# Altium project LPCXpresso55SXX.PrjPcb (part 1 of 2)
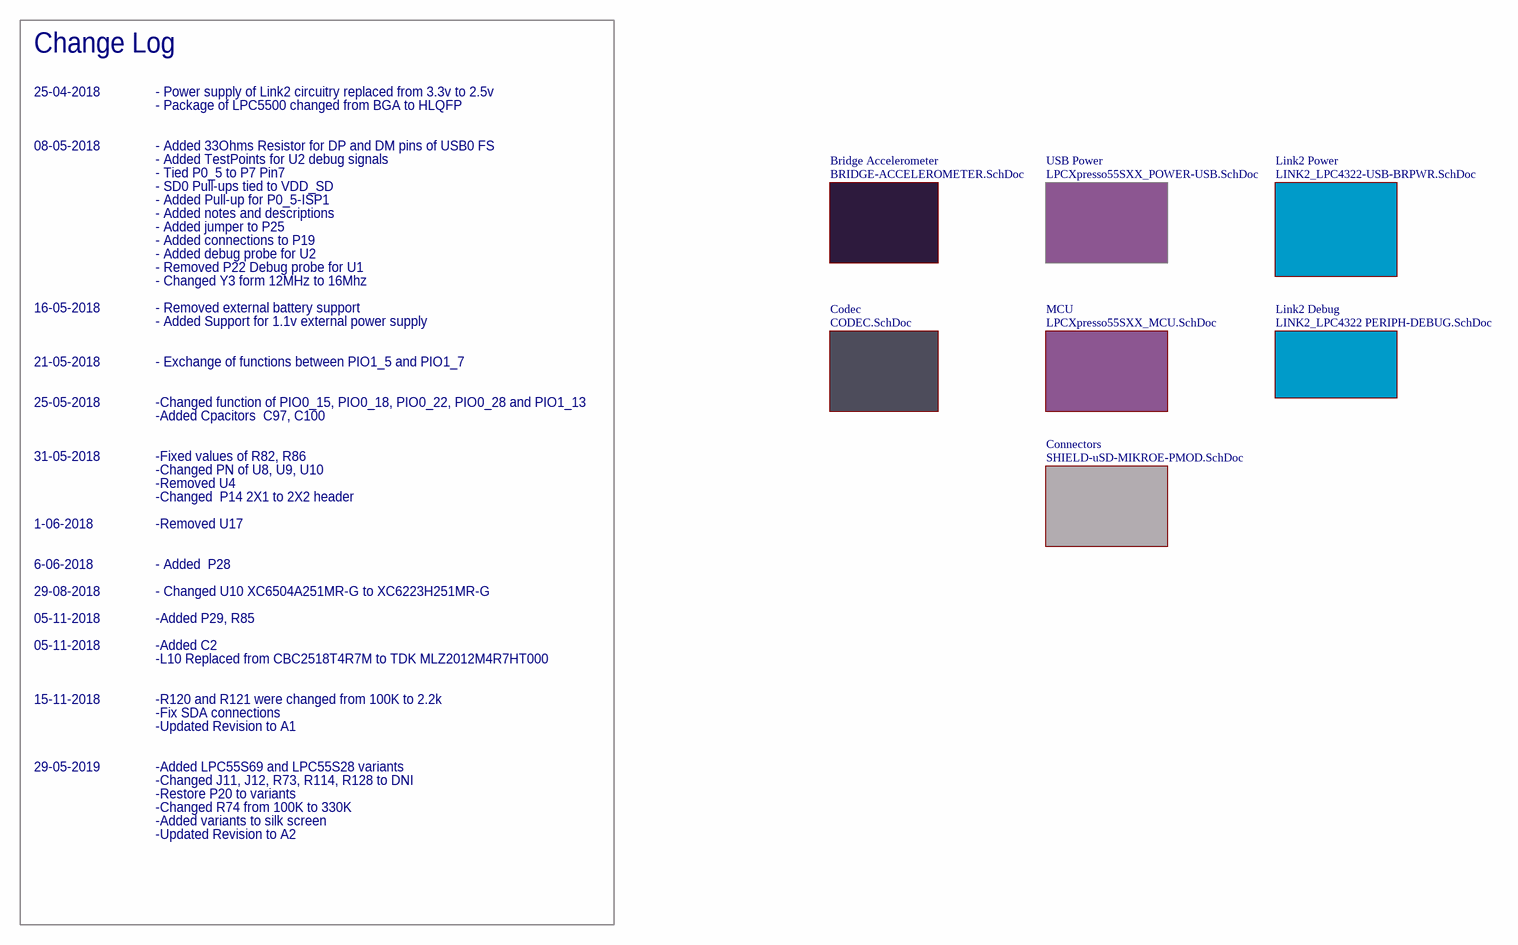
[diagram p0: LPCXpresso55SXX.SchDoc]
8 sheets, 336 parts. Net scope: global (net labels, ports and power ports of the same name join across sheets).
Board file: LPCXpresso55SXX.PcbDoc
Sheets:
  LPCXpresso55SXX.SchDoc
    USB Power = LPCXpresso55SXX_POWER-USB.SchDoc
    MCU = LPCXpresso55SXX_MCU.SchDoc
    Connectors = SHIELD-uSD-MIKROE-PMOD.SchDoc
    Bridge Accelerometer = BRIDGE-ACCELEROMETER.SchDoc
    Codec = CODEC.SchDoc
    Link2 Debug = LINK2_LPC4322 PERIPH-DEBUG.SchDoc
    Link2 Power = LINK2_LPC4322-USB-BRPWR.SchDoc

## Sheet LPCXpresso55SXX.SchDoc
size A3; CheckedBy: José Ogando; Engineer: Eduardo Teofilo; Revision: A2; SheetNumber: 1; SheetTotal: 8

### Sub-sheets
Bridge Accelerometer = BRIDGE-ACCELEROMETER.SchDoc: no entries
Codec = CODEC.SchDoc: no entries
Connectors = SHIELD-uSD-MIKROE-PMOD.SchDoc: no entries
Link2 Debug = LINK2_LPC4322 PERIPH-DEBUG.SchDoc: no entries
Link2 Power = LINK2_LPC4322-USB-BRPWR.SchDoc: no entries
MCU = LPCXpresso55SXX_MCU.SchDoc: no entries
USB Power = LPCXpresso55SXX_POWER-USB.SchDoc: no entries

### Notes on the sheet
- Change Log
- 25-04-2018
- - Power supply of Link2 circuitry replaced from 3.3v to 2.5v
- - Package of LPC5500 changed from BGA to HLQFP
- 08-05-2018
- - Added 33Ohms Resistor for DP and DM pins of USB0 FS
- - Added TestPoints for U2 debug signals
- - Tied P0_5 to P7 Pin7
- - SD0 Pull-ups tied to VDD_SD
- - Added Pull-up for P0_5-ISP1
- - Added notes and descriptions
- - Added jumper to P25
- - Added connections to P19
- - Added debug probe for U2
- - Removed P22 Debug probe for U1
- 16-05-2018
- - Changed Y3 form 12MHz to 16Mhz
- - Removed external battery support
- - Added Support for 1.1v external power supply
- 21-05-2018
- 25-05-2018
- - Exchange of functions between PIO1_5 and PIO1_7
- -Changed function of PIO0_15, PIO0_18, PIO0_22, PIO0_28 and PIO1_13
- 31-05-2018
- -Added Cpacitors  C97, C100
- -Fixed values of R82, R86
- -Changed PN of U8, U9, U10
- 1-06-2018
- -Removed U4
- -Changed  P14 2X1 to 2X2 header
- -Removed U17
- 6-06-2018
- 29-08-2018
- - Added  P28
- - Changed U10 XC6504A251MR-G to XC6223H251MR-G
- 05-11-2018
- -Added P29, R85
- -Added C2
- -L10 Replaced from CBC2518T4R7M to TDK MLZ2012M4R7HT000
- 15-11-2018
- -R120 and R121 were changed from 100K to 2.2k
- -Fix SDA connections
- -Updated Revision to A1
- 29-05-2019
- -Changed J11, J12, R73, R114, R128 to DNI
- -Restore P20 to variants
- -Changed R74 from 100K to 330K
- -Added LPC55S69 and LPC55S28 variants
- -Updated Revision to A2
- -Added variants to silk screen
- Elaborated by:
- Checked by:
- Revision:
- Last revision date:

## Sheet LPCXpresso55SXX_POWER-USB.SchDoc
size A3; CheckedBy: José Ogando; Engineer: Eduardo Teofilo; Revision: A2; SheetNumber: 2; SheetTotal: 8
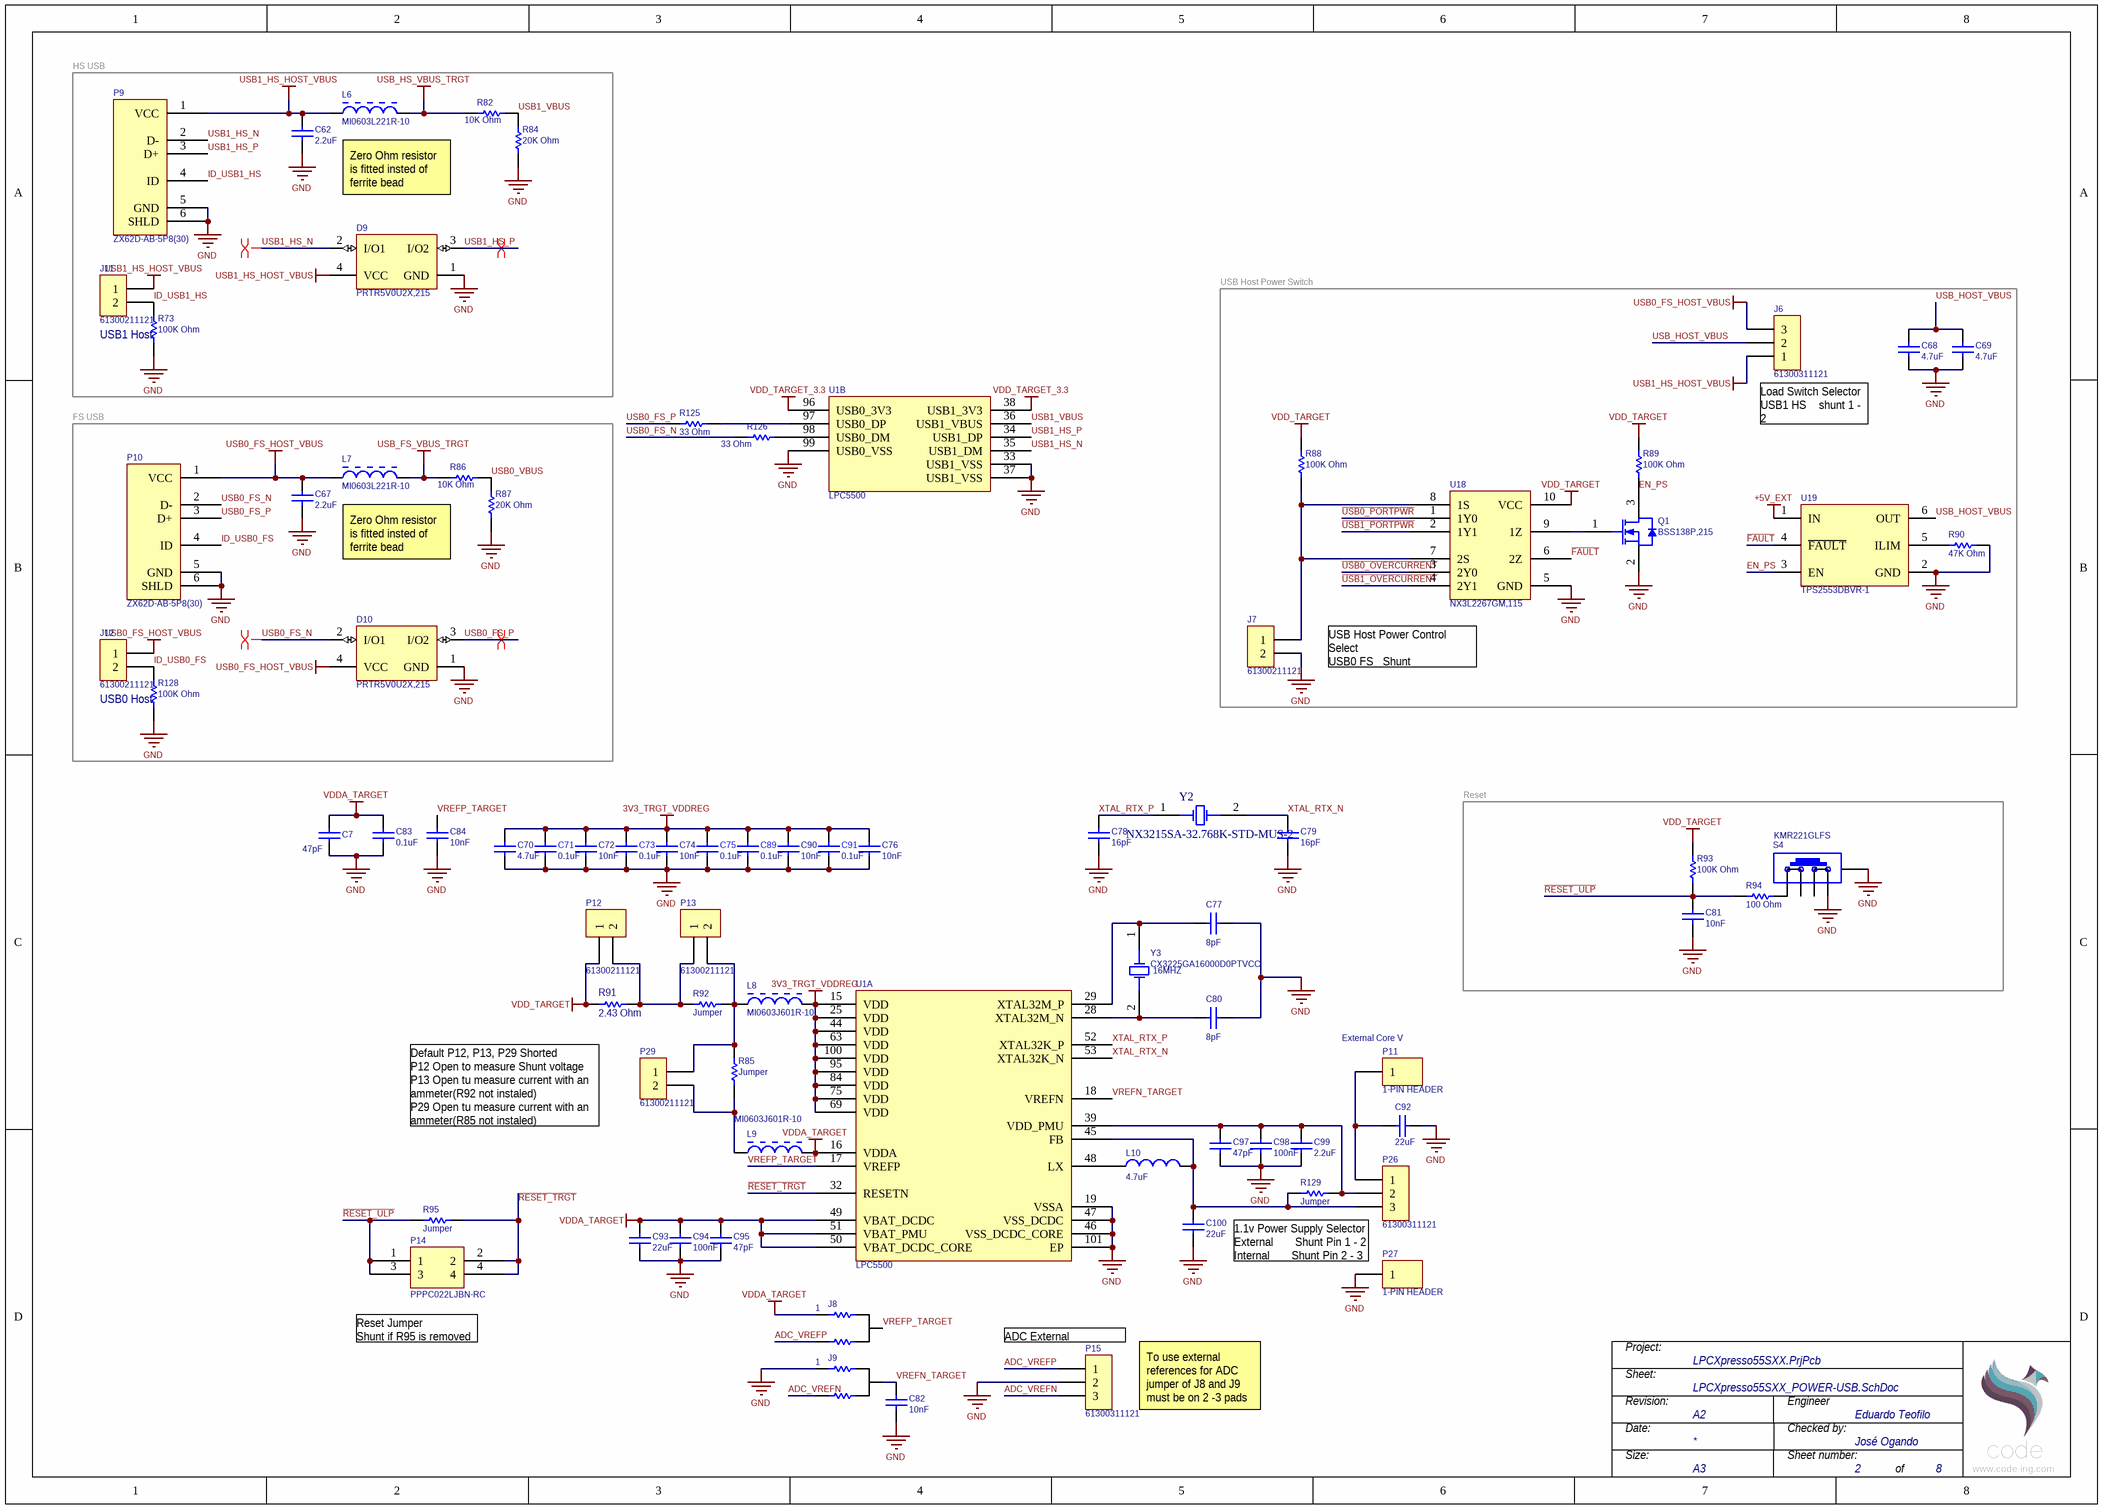
[diagram p1: LPCXpresso55SXX_POWER-USB.SchDoc]

### Parts
C7  value 47pF  [CAPC0402(1005)60_L]  (hidden comment: CAP 47pF 16V 0402(1005))
C62  value 2.2uF  [CAPC0402(1005)60_L]  (hidden comment: CAP 2.2uF 10V 0402(1005))
C67  value 2.2uF  [CAPC0402(1005)60_L]  (hidden comment: CAP 2.2uF 10V 0402(1005))
C68  value 4.7uF  [CAPC0603(1608)100_L]  (hidden comment: CAP 4.7uF 10V 0603(1608))
C69  value 4.7uF  [CAPC0603(1608)100_L]  (hidden comment: CAP 4.7uF 10V 0603(1608))
C70  value 4.7uF  [CAPC0603(1608)100_L]  (hidden comment: CAP 4.7uF 10V 0603(1608))
C71  value 0.1uF  [CAPC1005]  (hidden comment: CC0402KRX7R7BB104)
C72  value 10nF  [CAPC0402(1005)60_L]  (hidden comment: CAP 10nF 25V 0402(1005))
C73  value 0.1uF  [CAPC1005]  (hidden comment: CC0402KRX7R7BB104)
C74  value 10nF  [CAPC0402(1005)60_L]  (hidden comment: CAP 10nF 25V 0402(1005))
C75  value 0.1uF  [CAPC1005]  (hidden comment: CC0402KRX7R7BB104)
C76  value 10nF  [CAPC0402(1005)60_L]  (hidden comment: CAP 10nF 25V 0402(1005))
C77  value 8pF  [0402_L]  (hidden comment: GRM1555C1E8R0CA01D)
C78  value 16pF  [CAPC0402(1005)60_L]  (hidden comment: CAP 16pF 25V 0402(1005))
C79  value 16pF  [CAPC0402(1005)60_L]  (hidden comment: CAP 16pF 25V 0402(1005))
C80  value 8pF  [0402_L]  (hidden comment: GRM1555C1E8R0CA01D)
C81  value 10nF  [CAPC0402(1005)60_L]  (hidden comment: CAP 10nF 25V 0402(1005))
C82  value 10nF  [CAPC0402(1005)60_L]  (hidden comment: CAP 10nF 25V 0402(1005))
C83  value 0.1uF  [CAPC1005]  (hidden comment: CC0402KRX7R7BB104)
C84  value 10nF  [CAPC0402(1005)60_L]  (hidden comment: CAP 10nF 25V 0402(1005))
C89  value 0.1uF  [CAPC1005]  (hidden comment: CC0402KRX7R7BB104)
C90  value 10nF  [CAPC0402(1005)60_L]  (hidden comment: CAP 10nF 25V 0402(1005))
C91  value 0.1uF  [CAPC1005]  (hidden comment: CC0402KRX7R7BB104)
C92  value 22uF  [CAPC0805(2012)145_L]  (hidden comment: CAP 22uF 16V 0805(2012))
C93  value 22uF  [CAPC0805(2012)145_L]  (hidden comment: CAP 22uF 16V 0805(2012))
C94  value 100nF  [CAPC0603(1608)100_L]  (hidden comment: CAP 100nF 25V 0603(1608))
C95  value 47pF  [CAPC0603(1608)100_L]  (hidden comment: CAP 47pF 16V 0603(1608))
C97  value 47pF  [CAPC0603(1608)100_L]  (hidden comment: CAP 47pF 16V 0603(1608))
C98  value 100nF  [CAPC0603(1608)100_L]  (hidden comment: CAP 100nF 25V 0603(1608))
C99  value 2.2uF  [CAPC0402(1005)60_L]  (hidden comment: CAP 2.2uF 10V 0402(1005))
C100  value 22uF  [CAPC0805(2012)145_L]  (hidden comment: CAP 22uF 16V 0805(2012))
D9  PRTR5V0U2X,215  [NXP-SOT143B-4_V]
D10  PRTR5V0U2X,215  [NXP-SOT143B-4_V]
J6  61300311121  [61300311121]
J7  61300211121  [61300211121]
J8  Resistor - Jumper  [0402_R - JMP]  (value not drawn)
J9  Resistor - Jumper  [0402_R - JMP]  (value not drawn)
J11  61300211121  [61300211121]
J12  61300211121  [61300211121]
L6  MI0603L221R-10  [LIRD-HZ0603C601R-10-2_V]
L7  MI0603L221R-10  [LIRD-HZ0603C601R-10-2_V]
L8  MI0603J601R-10  [LIRD-MI0603J601R-10_V]
L9  MI0603J601R-10  [LIRD-MI0603J601R-10_V]
L10  value 4.7uF  [0805(2012)]  (hidden comment: MLZ2012M4R7HT000)
P9  ZX62D-AB-5P8(30)  [ZX62D-AB-5P8(30)]
P10  ZX62D-AB-5P8(30)  [ZX62D-AB-5P8(30)]
P11  1-PIN HEADER  [HDR1X1]
P12  61300211121  [61300211121]
P13  61300211121  [61300211121]
P14  PPPC022LJBN-RC  [PPPC022LJBN-RC]
P15  61300311121  [61300311121]
P26  61300311121  [61300311121]
P27  1-PIN HEADER  [HDR1X1]
P29  61300211121  [61300211121]
Q1  BSS138P,215  [NXP-SOT23_N]
R73  value 100K Ohm  [RESC1005X40X25LL05T05]  (hidden comment: ERJ-2RKF1003X)
R82  value 10K Ohm  [RESC0402(1005)_N]  (hidden comment: 10K 1% 0402(1005))
R84  value 20K Ohm  [RESC0402(1005)_M]  (hidden comment: 20K 1% 0402(1005))
R85  Jumper  [RESC0402(1005)_L]
R86  value 10K Ohm  [RESC0402(1005)_N]  (hidden comment: 10K 1% 0402(1005))
R87  value 20K Ohm  [RESC0402(1005)_M]  (hidden comment: 20K 1% 0402(1005))
R88  value 100K Ohm  [RESC1005X40X25LL05T05]  (hidden comment: ERJ-2RKF1003X)
R89  value 100K Ohm  [RESC1005X40X25LL05T05]  (hidden comment: ERJ-2RKF1003X)
R90  value 47K Ohm  [RESC0402(1005)_L]  (hidden comment: 47K 1% 0402(1005))
R91  value 2.43 Ohm  [RESC0402(1005)_L]  (hidden comment: 2R43 1% 0402(1005))
R92  Jumper  [RESC0402(1005)_L]
R93  value 100K Ohm  [RESC1005X40X25LL05T05]  (hidden comment: ERJ-2RKF1003X)
R94  value 100 Ohm  [RESC0402(1005)_L]  (hidden comment: 100R 5% 0402(1005))
R95  Jumper  [RESC0402(1005)_L]
R125  value 33 Ohm  [RESC0402(1005)_L]  (hidden comment: 33R 1% 0402(1005))
R126  value 33 Ohm  [RESC0402(1005)_L]  (hidden comment: 33R 1% 0402(1005))
R128  value 100K Ohm  [RESC1005X40X25LL05T05]  (hidden comment: ERJ-2RKF1003X)
R129  Jumper  [RESC0402(1005)_L]
S4  KMR221GLFS  [KMR221GLFS]
U1  LPC5500  [LQFP EP 100]  (parts A,B of 4)
U18  NX3L2267GM,115  [XQFN10]
U19  TPS2553DBVR-1  [DBV0006A_N]
Y2  NX3215SA-32.768K-STD-MUS-2  [2-SMD 3.2x1.5mm]
Y3  CX3225GA16000D0PTVCC  value 16MHZ  [CX3225GA]

### Blocks framed on the sheet
USB1 Host: C62 D9 J11 L6 P9 R73 R82 R84
USB Host Power Switch: C68 C69 J6 J7 Q1 R88-R90 U18 U19
USB0 Host: C67 D10 J12 L7 P10 R86 R87 R128
Reset: C81 R93 R94 S4

### Nets
3V3_TRGT_VDDREG: C70.2 C71.1 C72.2 C73.1 C74.2 C75.1 C76.2 C89.1 C90.2 C91.1 L8.2 U1.15(VDD) U1.25(VDD) U1.44(VDD) U1.63(VDD) U1.69(VDD) U1.75(VDD) U1.84(VDD) U1.95(VDD) U1.100(VDD)
+5V_EXT: U19.1(IN)
GND: C7.1 C62.1 C67.1 C68.1 C69.1 C70.1 C71.2 C72.1 C73.2 C74.1 C75.2 C76.1 C77.2 C78.1 C79.1 C80.2 C81.1 C82.1 C83.2 C84.1 C89.2 C90.1 C91.2 C92.2 C93.1 C94.1 C95.1 C97.1 C98.1 C99.1 C100.2 D9.1(GND) D10.1(GND) J7.2 J9.1 P9.5(GND) P9.6(SHLD) P10.5(GND) P10.6(SHLD) P15.2 P27.1 Q1.2(S) R73.1 R84.1 R87.1 R90.2 R128.1 S4.2 S4.5 U1.19(VSSA) U1.33(USB1_VSS) U1.37(USB1_VSS) U1.46(VSS_DCDC_CORE) U1.47(VSS_DCDC) U1.99(USB0_VSS) U1.101(EP) U18.5(GND) U19.2(GND)
USB0_FS_HOST_VBUS: C67.2 D10.4(VCC) J6.3 J12.1 L7.1 P10.1(VCC)
USB1_HS_HOST_VBUS: C62.2 D9.4(VCC) J6.1 J11.1 L6.1 P9.1(VCC)
USB_FS_VBUS_TRGT: L7.2 R86.1
USB_HS_VBUS_TRGT: L6.2 R82.1
VDD_TARGET: P12.1 R88.2 R89.2 R91.1 R93.2 U18.10(VCC)
VDD_TARGET_3.3: U1.38(USB1_3V3) U1.96(USB0_3V3)
VDDA_TARGET: C7.2 C83.1 C93.2 C94.2 C95.2 J8.1 L9.2 U1.16(VDDA) U1.49(VBAT_DCDC) U1.50(VBAT_DCDC_CORE) U1.51(VBAT_PMU)
ADC_VREFN: J9.3 P15.3
ADC_VREFP: J8.3 P15.1
EN_PS: Q1.3(D) R89.1 U19.3(EN)
~{FAULT}: U18.6(2Z) U19.4(~{FAULT})
ID_USB0_FS: J12.2 P10.4(ID) R128.2
ID_USB1_HS: J11.2 P9.4(ID) R73.2
~{RESET_TRGT}: P14.2 P14.4 R95.1 U1.32(RESETN)
~{RESET_ULP}: C81.2 P14.1 P14.3 R93.1 R94.1 R95.2
~{USB0_OVERCURRENT}: U18.3(2Y0)
~{USB0_PORTPWR}: U18.1(1Y0)
~{USB1_OVERCURRENT}: U18.4(2Y1)
~{USB1_PORTPWR}: U18.2(1Y1)
USB0_FS_N: D10.2(I/O1) P10.2(D-) R126.1
USB0_FS_P: D10.3(I/O2) P10.3(D+) R125.1
USB0_VBUS: R86.2 R87.2
USB1_HS_N: D9.2(I/O1) P9.2(D-) U1.35(USB1_DM)
USB1_HS_P: D9.3(I/O2) P9.3(D+) U1.34(USB1_DP)
USB1_VBUS: R82.2 R84.2 U1.36(USB1_VBUS)
USB_HOST_VBUS: C68.2 C69.2 J6.2 U19.6(OUT)
VREFN_TARGET: C82.2 J9.2 U1.18(VREFN)
VREFP_TARGET: C84.2 J8.2 U1.17(VREFP)
XTAL_RTX_N: C79.2 U1.53(XTAL32K_N) Y2.2(OSC2)
XTAL_RTX_P: C78.2 U1.52(XTAL32K_P) Y2.1(OSC1)
NetC77_1: C77.1 U1.29(XTAL32M_P) Y3.1(OSC1)
NetC80_1: C80.1 U1.28(XTAL32M_N) Y3.2
NetC92_1: C92.1 P11.1 P26.1
NetC97_2: C97.2 C98.2 C99.2 P26.2 R129.1 U1.39(VDD_PMU)
NetC100_1: C100.1 L10.2 P26.3 R129.2 U1.45(FB)
NetJ7_1: J7.1 R88.1 U18.7(2S) U18.8(1S)
NetL8_1: L8.1 P13.2 P29.1 R85.1 R92.1
NetL9_1: L9.1 P29.2 R85.2
NetL10_1: L10.1 U1.48(LX)
NetP12_2: P12.2 P13.1 R91.2 R92.2
NetQ1_1: Q1.1(G) U18.9(1Z)
NetR90_1: R90.1 U19.5(ILIM)
NetR94_2: R94.2 S4.1
NetR125_2: R125.2 U1.97(USB0_DP)
NetR126_2: R126.2 U1.98(USB0_DM)

Not connected (* = marked no-connect by the designer): S4 3 4

### Layout directives
differential pair: USB0_FS_N, USB0_FS_P, USB1_HS_N, USB1_HS_P

### Notes on the sheet
- HS USB
- Zero Ohm resistor is fitted insted of ferrite bead
- FS USB
- (near J6) Load Switch Selector
  USB1 HS    shunt 1 - 2
  USB0 FS     shunt 2 -3
- USB Host Power Control Select
  USB0 FS   Shunt
  USB1 HS  Open
- (near P11) External Core V
- (near R91) Default P12, P13, P29 Shorted
  P12 Open to measure Shunt voltage
  P13 Open tu measure current with an ammeter(R92 not instaled)
  P29 Open tu measure current with an ammeter(R85 not instaled)
- 1.1v Power Supply Selector
  External       Shunt Pin 1 - 2
  Internal       Shunt Pin 2 - 3
- (near J8) 1
- (near P14) Reset Jumper
  Shunt if R95 is removed
- (near J9) 1
- (near P15) ADC External References
- To use external references for ADC jumper of J8 and J9 must be on 2 -3 pads
- Project:
- Sheet:
- Revision:
- Date:
- Size:
- Sheet number:
- Engineer
- Checked by:
- A3
- of
- www.code-ing.com

### Library data of the parts
C7 = CMP-1034-01078-1: CAP 47pF 16V ±1% 0402 (1005 Metric) Thickness 0.6mm SMD; Tolerance: Â±1%; Case-EIA: 0402; Case-Metric: 1005; Technology: SMT; Rated Voltage: 16 V; Max Thickness: 0.6 mm
C62 C67 C99 = CMP-1034-02127-1: CAP 2.2uF 10V ±10% 0402 (1005 Metric) Thickness 0.6mm SMD; Case-EIA: 0402; Tolerance: Â±10%; Case-Metric: 1005; Technology: SMT; Rated Voltage: 10 V; Max Thickness: 0.6 mm
C68-C70 = CMP-1035-02785-1: CAP 4.7uF 10V ±10% 0603 (1608 Metric) Thickness 1mm SMD; Tolerance: Â±10%; Case-EIA: 0603; Case-Metric: 1608; Max Thickness: 1 mm; Technology: SMT; Rated Voltage: 10 V
C71 C73 C75 C83 C89 C91 = CMP-0001-00074-1: Capacitor, Yageo, Ceramic, 0.1uF 10% 16V 0402 (1005) X7R; Polarity: Non-Polarized; ClassName: Board Template Device; Rated Voltage: 16 V; Status: Production; Tolerance: 10 %; Mounting Technology: Surface Mount; Technology: Ceramic; Category: Capacitor; Dielectric: X7R; Publisher: Altium
C72 C74 C76 C81 C82 C84 C90 = CMP-1034-01880-1: CAP 10nF 25V ±10% 0402 (1005 Metric) Thickness 0.6mm SMD; Tolerance: Â±10%; Case-Metric: 1005; Case-EIA: 0402; Technology: SMT; Max Thickness: 0.6 mm; Rated Voltage: 25 V
C77 C80 = Capacitor: CAP CER 8PF 25V C0G/NP0 0402; Manufacturer: Murata Electronics North America; Modified by: *; DigiKey: *; Indications: *; Manufacturer part #: GRM1555C1E8R0CA01D; Created by: *; Creation date: *
C78 C79 = CMP-1034-00833-1: CAP 16pF 25V ±0.5pF 0402 (1005 Metric) Thickness 0.6mm SMD; Tolerance: Â±0.5pF; Case-EIA: 0402; Case-Metric: 1005; Rated Voltage: 25 V; Max Thickness: 0.6 mm; Technology: SMT
C92 C93 C100 = CMP-1036-04946-1: CAP 22uF 16V ±20% 0805 (2012 Metric) Thickness 1.45mm SMD; Tolerance: Â±20%; Case-Metric: 2012; Case-EIA: 0805; Max Thickness: 1.45 mm; Rated Voltage: 16 V; Technology: SMT
C94 C98 = CMP-1035-02589-1: CAP 100nF 25V ±20% 0603 (1608 Metric) Thickness 1mm SMD; Case-EIA: 0603; Tolerance: Â±20%; Case-Metric: 1608; Max Thickness: 1 mm; Technology: SMT; Rated Voltage: 25 V
C95 C97 = CMP-1035-01048-1: CAP 47pF 16V ±5pF 0603 (1608 Metric) Thickness 1mm SMD; Case-EIA: 0603; Case-Metric: 1608; Technology: SMT; Tolerance: ±5pF; Rated Voltage: 16 V; Max Thickness: 1 mm
D9 D10 = CMP-2000-05285-1: Ultra Low Capacitance Double Rail-to-Rail ESD Protection Diode, 5.5 V, 1 pF, -40 to 85 degC, 4-Pin SOT143B, RoHS, Tape and Reel; Manufacturer: NXP Semiconductors; Capacitance Value: 16pF; Number of Elements: 1; Rad Hardened: No; Reverse Breakdown Voltage: 6V; Working Voltage (Max): 5.5V; Polarity: Uni-Directional; Configuration: Quad; Leakage Current: 0.1uA; Product Height (mm): 1mm; Suppressor Type: DiodeArrays; Product Length (mm): 3mm; Product Depth (mm): 1.4mm; ESD Protection Voltage: 8KV@ContactDisc; Package Type: SOT; Mounting: SurfaceMount; Packaging: TapeandReel; Datasheet Version: Rev. 02, 01/2008; Reverse Stand-off Voltage: 5.5V; Manufacturer URL: http://www.nxp.com/; Operating Temp Range: -40Cto85C; Operating Temperature Classification: Industrial; Working Voltage: 5.5V; Operating Temperature Min Deg. C: -40C; Datasheet URL: https://datasheet.ciiva.com/4479/prtr5v0u2x-102853-4479461.pdf; Leakage Current (Max): 0.1uA; Direction Type: Uni-Directional; Pin Count: 3+Tab; Operating Temperature Max Deg. C: 85C; Mounting Style: SurfaceMount; Package / Case: SOT
J6 = 61300311121: HEADER 3POS SNGL T/H 2.54MM; Manufacturer: Wurth Electronics Inc; Manufacturer part #: 61300311121; DigiKey: *; Modified by: *; Value: *; Created by: gmoreno; Creation date: 28-Jul-2012
J7 = 61300211121: HEADER 2POS SNGL T/H 2.54MM; Manufacturer: Wurth Electronics Inc; Manufacturer part #: 61300211121; Modified by: *; Value: *; Created by: gmoreno; Creation date: 28-Jul-2012
J8 J9 = Resistor - Jumper: *; Indications: *; Created by: *; Creation date: *; Manufacturer: *; Manufacturer part #: *; Modified by: *; Value: *
J11 J12 P12 P13 P29 = 61300211121: HEADER 2POS SNGL T/H 2.54MM; Manufacturer: Wurth Electronics Inc; Indications: DNI; Manufacturer part #: 61300211121; Modified by: *; Value: *; Created by: gmoreno; Creation date: 28-Jul-2012
L6 L7 = CMP-2000-06701-1: Chip Bead, 100 MHz, 2 A, -40 to 125 degC, 2-Pin SMD (0603), RoHS, Tape and Reel; Case Height: 0.5mm; Impedance: 220Ohms; Maximum DC Resistance: 80mOhms; Brand: LairdTechnologies; Case Length: 1.6mm; Maximum DC Current: 2A; Unit Weight: 0.000192oz; Test Frequency: 100MHz; Package Description: 2-Pin Surface Mount Device, Body 1.6 x 0.8 mm; Datasheet URL: http://cdn.lairdtech.com/home/brandworld/files/MI0603L221R-10.pdf; Package Reference: 0603; Factory Pack Quantity: 4000; Mounting Technology: SurfaceMount; Packaging: Reel; Case Width: 0.5mm; Operating Temperature Range: -40Cto+125C; Dimensions: 0.5mmWx1.6mmLx0.5mmH; Package / Case: 0603(1608metric); Product Category: EMIFilterBeads,Chips&Arrays; Series: MI; Manufacturer URL: https://www.lairdtech.com/; Termination Style: SMD/SMT; Manufacturer: LairdTechnologies; Product: FerriteChipBeads; Datasheet Version: Rev. E, 08/2013; RoHS: Details
L8 L9 = CMP-2000-06700-1: Ferrite Bead, 600 Ohm, 1 A, -40 to 125 degC, 2-Pin SMD, RoHS, Tape and Reel; Manufacturer: Laird; DC Resistance (DCR) (Max): 200mOhm; Online Catalog: MISeries; Number of Lines: 1; Kits: 240-2227-ND-KITEMIFERRITEBEADCHIPSMD; Other Names: 240-2371-1; Impedance @ Frequency: 600Ohm@100MHz; Filter Type: PowerLine; Current Rating (Max): 1A; Catalog Drawings: (HI,HZ,LI,MI)0603Series_0.95mmMax.Height; Datasheet Version: Rev. C, 08/2013; Ratings: -; Package Description: 2-Pin Surface Mount Device, Body 1.6 x 0.8 mm; Operating Temperature: -40°C~125°C; Category: Filters; Mounting Type: SurfaceMount; Size / Dimension: 0.063"Lx0.031"W(1.60mmx0.80mm); Family: FerriteBeadsandChips; Package Reference: MI00603J601R-10; Manufacturer URL: https://www.lairdtech.com/; Height (Max): 0.037"(0.95mm); Series: MI; Packaging: CutTape(CT); Mounting Technology: SurfaceMount; Package / Case: 0603(1608Metric); Standard Package: 1; Datasheet URL: http://cdn.lairdtech.com/home/brandworld/files/MI0603J601R-10.pdf
L10 = MLZ2012M4R7HT000: FIXED IND 4.7UH 400MA 340 MOHM; Manufacturer: TDK Corporation; Manufacturer part #: MLZ2012M4R7HT000; Indications: *; Modified by: *; Created by: eteofilo; Creation date: 06-Nov-2018
P9 P10 = ZX62D-AB-5P8(30): CONN RCPT USB MICRO AB SMD; Manufacturer: Hirose Electric Co Ltd; Manufacturer part #: ZX62D-AB-5P8(30); Created by: eteofilo; Creation date: 16-Apr-2018; Modified by: *; Value: *; Indications: *
P11 P27 = 1-PIN HEADER: PTH HEADER 40MIL DRILL 70MIL PAD; Indications: DNI
P14 = PPPC022LJBN-RC: CONN FEMALE 4POS DL .1" R/A GOLD; Manufacturer: Sullins Connector Solutions; Indications: DNI; Manufacturer Part #: PPPC022LJBN-RC; Created by: eteofilo; Creation date: 30-May-2018; Modified by: *; Value: *
P15 P26 = 61300311121: HEADER 3POS SNGL T/H 2.54MM; Manufacturer: Wurth Electronics Inc; Indications: DNI; Manufacturer part #: 61300311121; DigiKey: *; Modified by: *; Value: *; Created by: gmoreno; Creation date: 28-Jul-2012
Q1 = CMP-1259-00085-1: N-Channel Trench MOSFET, 60 V, 0.36 A, -55 to 150 degC, 3-Pin SOT23, Tape and Reel; Manufacturer: NXP Semiconductors; IDM [max] (A): 1.2; Channel Type: N; VDS [max] (V): 60; Packing: Tape & Reel; Automotive Qualified: Y; ID [max] (A): 0.36; ComponentLink1URL: http://www.nxp.com/; ComponentLink1Description: Manufacturer URL; Code_JEDEC: TO-236AB; PackageReference: SOT23; PartNumber: BSS138P,215; ComponentLink2URL: http://www.nxp.com/documents/data_sheet/BSS138P.pdf; PackageDescription: 3-Pin Small Outline Transistor Package, Body 2.9 x 1.3 mm, Pitch 0.95 mm; VGSth [typ] (V): 1.2; DatasheetVersion: Rev. 1; Mounting Technology: Surface Mount; ComponentLink3URL: http://www.nxp.com/documents/outline_drawing/sot023_po.pdf; ComponentLink3Description: Package Specification; ComponentLink2Description: Datasheet; PackageVersion: 06-03-16, 03/2006
R73 R128 = CMP-2002-00608-3: Chip Resistor, 100 KOhm, +/- 1%, 100 mW, -55 to 155 degC, 0402 (1005 Metric), RoHS, Tape and Reel; Manufacturer: Basic Passives; Power Rating: 100 mW; Voltage Rating: 50 V; Case\/Package: 0402; Indications: DNI; Case Code (Imperial): 0402; RoHSCompliant: true; Min Operating Temperature: -55 degC; Mount: Surface Mount; Packaging: Tape and Reel; PackageDescription: 2-Pin Surface Mount Device, Body 1 x 0.5 mm; Tolerance: 1%; REACH SVHC: Yes; ComponentLink1URL: http://www.panasonic.com/; ComponentLink1Description: Manufacturer URL; Package Quantity: 10000; Mounting Technology: Surface Mount; DatasheetVersion: 04/2015; PartNumber: ERJ-2RKF1003X; Height: 0.35 mm; Pins: 2; Length: 1 mm; Max Operating Temperature: 155 degC; ComponentLink2Description: Datasheet; ComponentLink2URL: http://industrial.panasonic.com/cdbs/www-data/pdf/RDA0000/AOA0000C86.pdf; PackageReference: 0402; Radiation Hardening: No; Width: 0.5 mm; Case Code (Metric): 1005
R82 R86 = CMP-1011-00623-1: 10K 0.063W 1% 0402 (1005 Metric)  SMD; Case-Metric: 1005; Case-EIA: 0402; Tolerance: 1 %; Technology: SMT; Power: 0.063 W
R84 R87 = CMP-1011-00655-1: 20K 0.063W 1% 0402 (1005 Metric)  SMD; Case-EIA: 0402; Case-Metric: 1005; Technology: SMT; Power: 0.063 W; Tolerance: 1 %
R85 R92 R95 R129 = CMP-1011-00001-1: Jumper 0402 (1005 Metric); Tolerance: None; Case-Metric: 1005; Case-EIA: 0402; Value: 0 Ohm; Power: None; Technology: SMT
R88 R89 R93 = CMP-2002-00608-3: Chip Resistor, 100 KOhm, +/- 1%, 100 mW, -55 to 155 degC, 0402 (1005 Metric), RoHS, Tape and Reel; Manufacturer: Basic Passives; Power Rating: 100 mW; Voltage Rating: 50 V; Case\/Package: 0402; Case Code (Imperial): 0402; RoHSCompliant: true; Min Operating Temperature: -55 degC; Mount: Surface Mount; Packaging: Tape and Reel; PackageDescription: 2-Pin Surface Mount Device, Body 1 x 0.5 mm; Tolerance: 1%; REACH SVHC: Yes; ComponentLink1URL: http://www.panasonic.com/; ComponentLink1Description: Manufacturer URL; Package Quantity: 10000; Mounting Technology: Surface Mount; DatasheetVersion: 04/2015; PartNumber: ERJ-2RKF1003X; Height: 0.35 mm; Pins: 2; Length: 1 mm; Max Operating Temperature: 155 degC; ComponentLink2Description: Datasheet; ComponentLink2URL: http://industrial.panasonic.com/cdbs/www-data/pdf/RDA0000/AOA0000C86.pdf; PackageReference: 0402; Radiation Hardening: No; Width: 0.5 mm; Case Code (Metric): 1005
R90 = CMP-1011-00699-1: 47K 0.063W 1% 0402 (1005 Metric)  SMD; Case-EIA: 0402; Case-Metric: 1005; Power: 0.063 W; Technology: SMT; Tolerance: 1 %
R91 = CMP-1011-00213-1: 2R43 0.063W 1% 0402 (1005 Metric)  SMD; Case-EIA: 0402; Case-Metric: 1005; Technology: SMT; Power: 0.063 W; Tolerance: 1 %
R94 = CMP-1011-00050-1: 100R 0.063W 5% 0402 (1005 Metric)  SMD; Case-Metric: 1005; Case-EIA: 0402; Power: 0.063 W; Technology: SMT; Tolerance: 5 %
R125 R126 = CMP-1011-00341-1: 33R 0.063W 1% 0402 (1005 Metric)  SMD; Case-Metric: 1005; Case-EIA: 0402; Tolerance: 1 %; Power: 0.063 W; Technology: SMT
S4 = KMR221GLFS: SWITCH TACTILE SPST-NO 0.05A 32V; Manufacturer: C&K; Created by: eteofilo; Creation Date: 06-Jul-2017; Indications: *; Manufacturer part #: KMR221GLFS; Modified by: *; Value: *
U1 = LPC5500: 32-bit ARM Cortex-M33, 312 KB SRAM, LPC55XX Series; Manufacturer: NXP; Manufacturer Part #: LPC5500; Created by: eteofilo; Creation Date: 05-Apr-2018; Modified by: *; Indications: *; Value: *
U18 = NX3L2267GM,115: IC ANALOG SWITCH SPDT 10XQFN; Manufacturer: NXP USA Inc.; Manufacturer part #: NX3L2267GM,115; Indications: *; Modified by: *; Creation date: 16-Apr-2018; Created by: eteofilo; Value: *
U19 = CMP-0337-00282-2: Adjustable, Active High, Latch-off, Current-Limited Power-Distribution Switch, 0.075 to 1.7 A Current Limit, -40 to 85 degC, 6-pin SOT-23 (DBV), Green (RoHS & no Sb/Br); Manufacturer: Texas Instruments; rDS(on) per FET(Typ)(mOhms): 100/DRV, 85/DBV; Vin(Max)(V): 6.5; Continuous Current(Max)(A): 1.5; Current Limit Accuracy @ 1A: +/-7.5% (925mA min / 1075mA max); Rating: Catalog; Number of Switches: 1; Vin(Min)(V): 2.5; Enable: Active High; Current Limit(A): 0.075 to 1.7; Code_JEDEC: MO-178-AB*; Current Limit Topology: Latch-off; Mounting Technology: Surface Mount; PackageDescription: 6-Pin Plastic Small-Outline Package, 2.9 x 1.6 mm Body, 0.95 mm Pitch, 2.8 mm Lead Span; PartNumber: TPS2553DBVR-1; Eco-Plan: Green (RoHS & no Sb/Br); DatasheetVersion: SLVS841E; ComponentLink1Description: Datasheet; PackageVersion: revK, Mar-2006; ComponentLink1URL: http://www.ti.com/general/docs/lit/getliterature.tsp?genericPartNumber=TPS2553-1&fileType=pdf; PackageReference: DBV0006A
Y2 = NX3215SA-32.768K-STD-MUS-2: CRYSTAL 32.7680KHZ 12.5PF SMD; Manufacturer: NDK; Value: 32.768KHz; Manufacturer Part #: NX3215SA-32.768K-STD-MUS-2; Creation Date: 05-Jun-2018; Created by: eteofilo; Modified by: *; Indications: *
Y3 = CX3225GA16000D0PTVCC: CRYSTAL 16.0000MHZ 8PF SMD; Manufacturer: Kyocera International Inc. Electronic Components; Manufacturer part #: CX3225GA16000D0PTVCC; Indications: *; Modified by: *; Created by: eteofilo; Creation date: 25-May-2018

## Sheet LPCXpresso55SXX_MCU.SchDoc
size A3; CheckedBy: José Ogando; Engineer: Eduardo Teofilo; Revision: A2; SheetNumber: 3; SheetTotal: 8
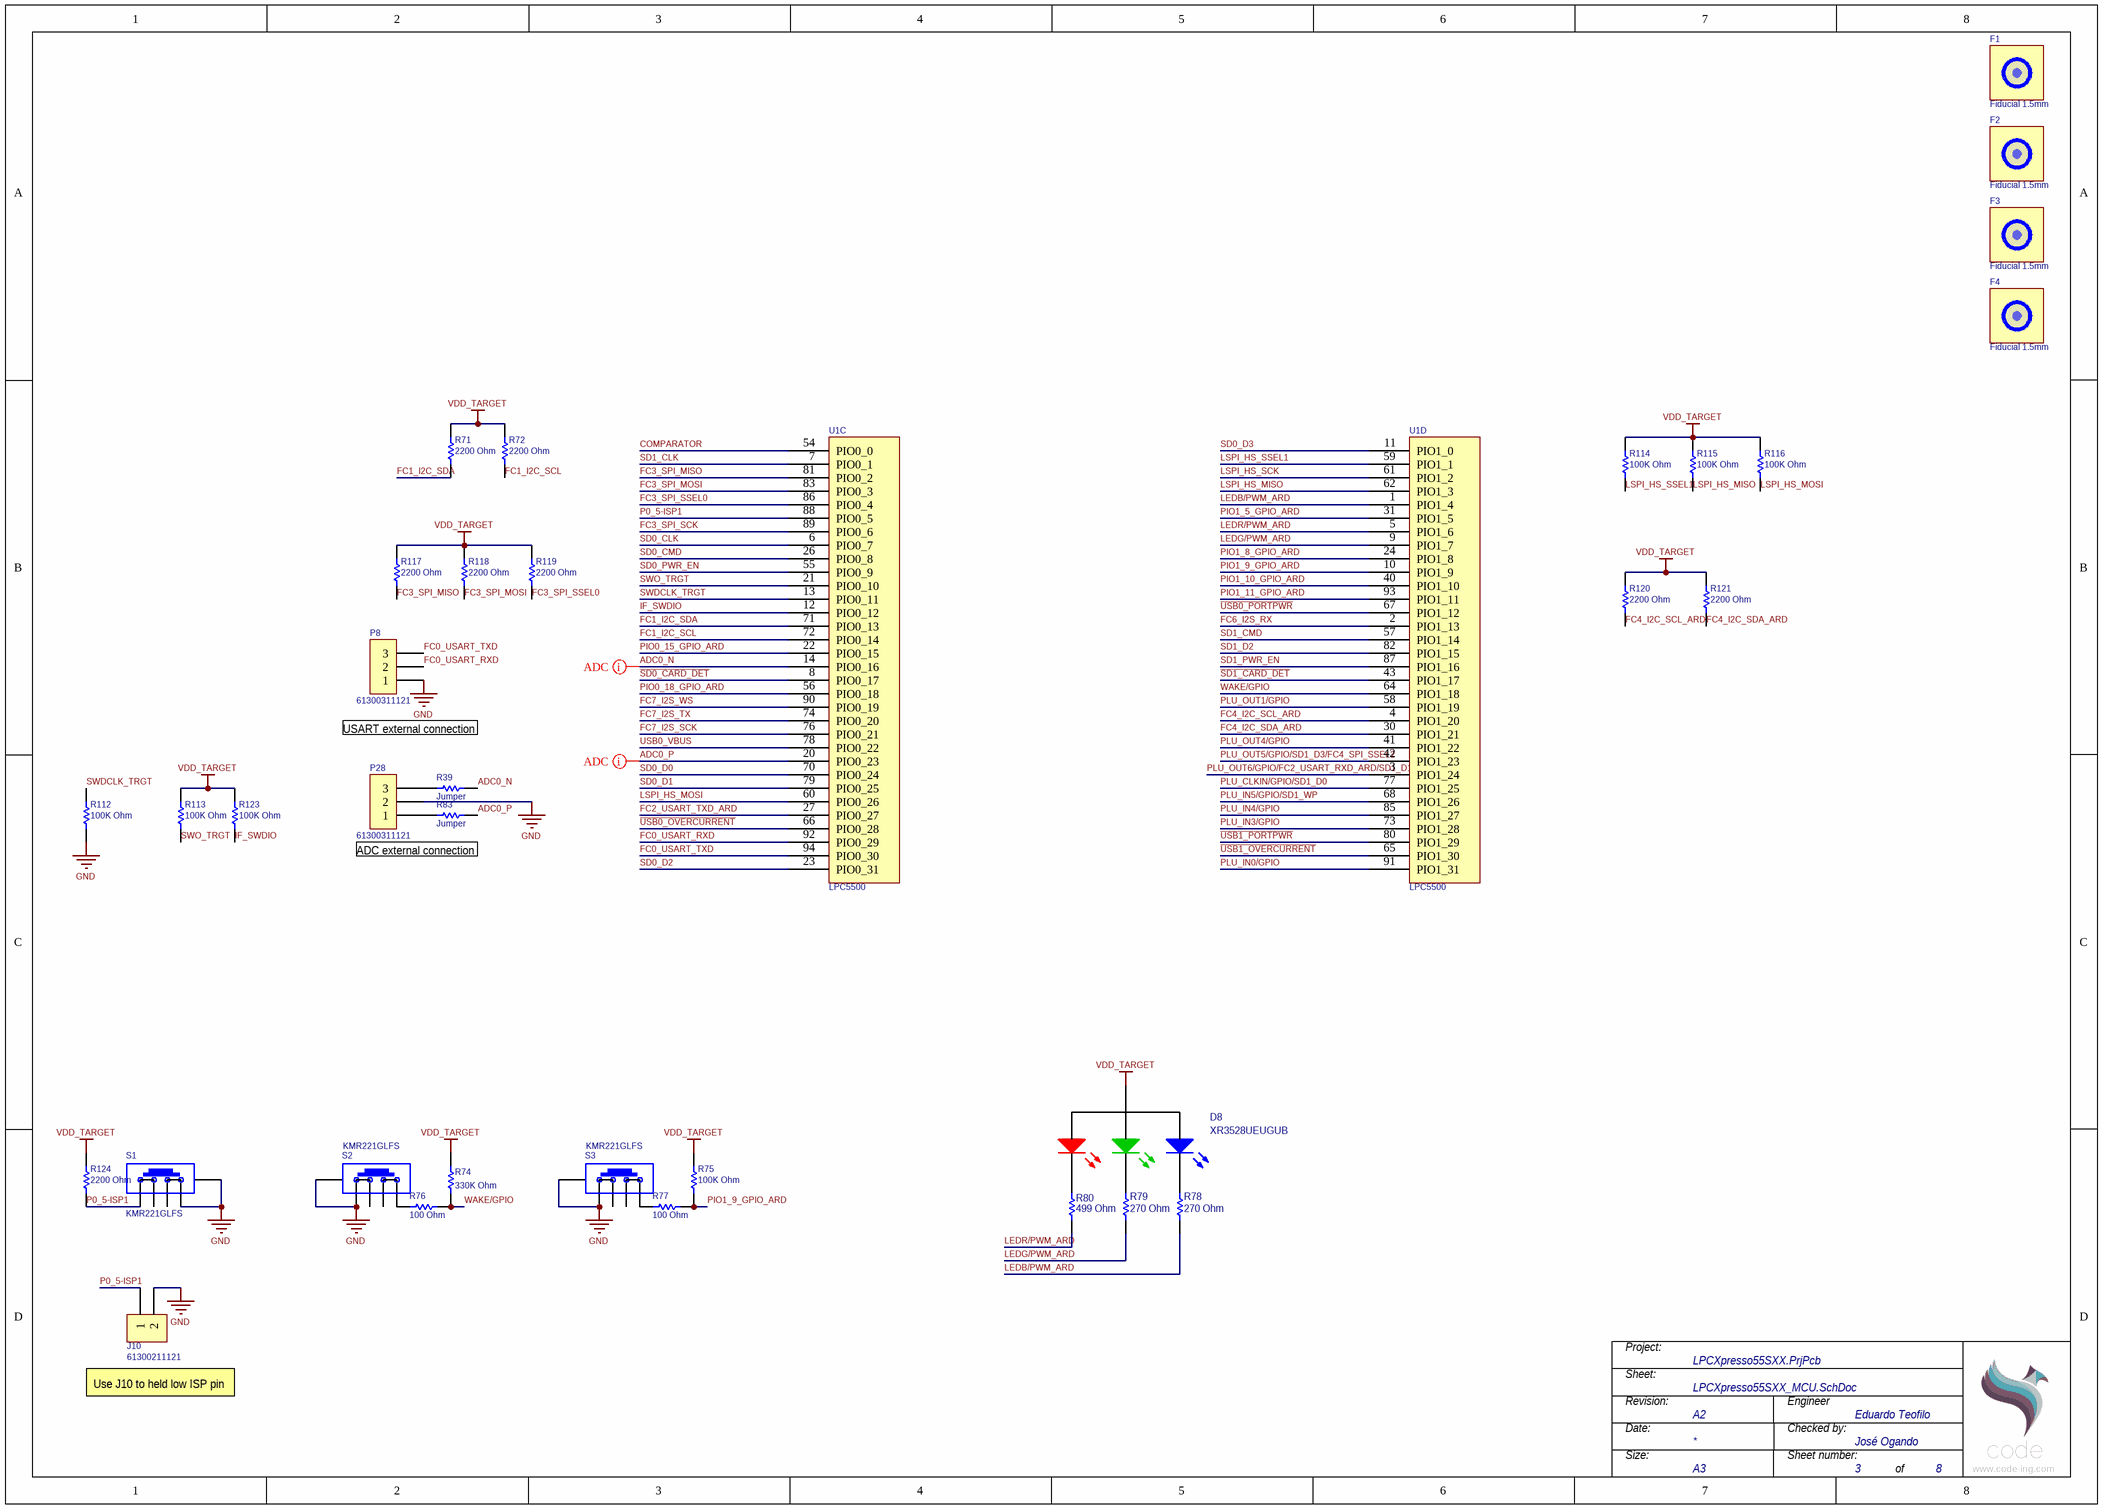
[diagram p2: LPCXpresso55SXX_MCU.SchDoc]

### Parts
D8  XR3528UEUGUB  [XR3528UEUGUB]
F1  Fiducial 1.5mm  [Fiducial 1.5mm]  (no BOM)
F2  Fiducial 1.5mm  [Fiducial 1.5mm]  (no BOM)
F3  Fiducial 1.5mm  [Fiducial 1.5mm]  (no BOM)
F4  Fiducial 1.5mm  [Fiducial 1.5mm]  (no BOM)
J10  61300211121  [61300211121]
P8  61300311121  [61300311121]
P28  61300311121  [61300311121]
R39  Jumper  [RESC0402(1005)_L]
R71  value 2200 Ohm  [RESC0402(1005)_L]  (hidden comment: 2K2 1% 0402(1005))
R72  value 2200 Ohm  [RESC0402(1005)_L]  (hidden comment: 2K2 1% 0402(1005))
R74  value 330K Ohm  [RESC0402(1005)_N]  (hidden comment: 330K 1% 0402(1005))
R75  value 100K Ohm  [RESC1005X40X25LL05T05]  (hidden comment: ERJ-2RKF1003X)
R76  value 100 Ohm  [RESC0402(1005)_L]  (hidden comment: 100R 5% 0402(1005))
R77  value 100 Ohm  [RESC0402(1005)_L]  (hidden comment: 100R 5% 0402(1005))
R78  value 270 Ohm  [RESC0402(1005)_L]  (hidden comment: 270R 1% 0402(1005))
R79  value 270 Ohm  [RESC0402(1005)_L]  (hidden comment: 270R 1% 0402(1005))
R80  value 499 Ohm  [RESC0402(1005)_L]  (hidden comment: 499R 1% 0402(1005))
R83  Jumper  [RESC0402(1005)_L]
R112  value 100K Ohm  [RESC1005X40X25LL05T05]  (hidden comment: ERJ-2RKF1003X)
R113  value 100K Ohm  [RESC1005X40X25LL05T05]  (hidden comment: ERJ-2RKF1003X)
R114  value 100K Ohm  [RESC1005X40X25LL05T05]  (hidden comment: ERJ-2RKF1003X)
R115  value 100K Ohm  [RESC1005X40X25LL05T05]  (hidden comment: ERJ-2RKF1003X)
R116  value 100K Ohm  [RESC1005X40X25LL05T05]  (hidden comment: ERJ-2RKF1003X)
R117  value 2200 Ohm  [RESC0402(1005)_L]  (hidden comment: 2K2 1% 0402(1005))
R118  value 2200 Ohm  [RESC0402(1005)_L]  (hidden comment: 2K2 1% 0402(1005))
R119  value 2200 Ohm  [RESC0402(1005)_L]  (hidden comment: 2K2 1% 0402(1005))
R120  value 2200 Ohm  [RESC0402(1005)_L]  (hidden comment: 2K2 1% 0402(1005))
R121  value 2200 Ohm  [RESC0402(1005)_L]  (hidden comment: 2K2 1% 0402(1005))
R123  value 100K Ohm  [RESC1005X40X25LL05T05]  (hidden comment: ERJ-2RKF1003X)
R124  value 2200 Ohm  [RESC0402(1005)_L]  (hidden comment: 2K2 1% 0402(1005))
S1  KMR221GLFS  [KMR221GLFS]
S2  KMR221GLFS  [KMR221GLFS]
S3  KMR221GLFS  [KMR221GLFS]
U1  LPC5500  [LQFP EP 100]  (parts C,D of 4)

### Nets
GND: J10.2 P8.1 P28.2 R112.1 S1.2 S1.5 S2.2 S2.5 S3.2 S3.5
VDD_TARGET: D8.2 R71.2 R72.2 R74.2 R75.2 R113.2 R114.2 R115.2 R116.2 R117.2 R118.2 R119.2 R120.2 R121.2 R123.2 R124.1
ADC0_N: R39.1 U1.14(PIO0_16)
ADC0_P: R83.1 U1.20(PIO0_23)
COMPARATOR: U1.54(PIO0_0)
FC0_USART_RXD: P8.2 U1.92(PIO0_29)
FC0_USART_TXD: P8.3 U1.94(PIO0_30)
FC1_I2C_SCL: R72.1 U1.72(PIO0_14)
FC1_I2C_SDA: R71.1 U1.71(PIO0_13)
FC2_USART_TXD_ARD: U1.27(PIO0_27)
FC3_SPI_MISO: R117.1 U1.81(PIO0_2)
FC3_SPI_MOSI: R118.1 U1.83(PIO0_3)
FC3_SPI_SCK: U1.89(PIO0_6)
FC3_SPI_SSEL0: R119.1 U1.86(PIO0_4)
FC4_I2C_SCL_ARD: R120.1 U1.4(PIO1_20)
FC4_I2C_SDA_ARD: R121.1 U1.30(PIO1_21)
FC6_I2S_RX: U1.2(PIO1_13)
FC7_I2S_SCK: U1.76(PIO0_21)
FC7_I2S_TX: U1.74(PIO0_20)
FC7_I2S_WS: U1.90(PIO0_19)
IF_SWDIO: R123.1 U1.12(PIO0_12)
LEDB/PWM_ARD: R78.1 U1.1(PIO1_4)
LEDG/PWM_ARD: R79.1 U1.9(PIO1_7)
LEDR/PWM_ARD: R80.1 U1.5(PIO1_6)
LSPI_HS_MISO: R115.1 U1.62(PIO1_3)
LSPI_HS_MOSI: R116.1 U1.60(PIO0_26)
LSPI_HS_SCK: U1.61(PIO1_2)
LSPI_HS_SSEL1: R114.1 U1.59(PIO1_1)
P0_5-ISP1: J10.1 R124.2 S1.1 U1.88(PIO0_5)
PIO0_15_GPIO_ARD: U1.22(PIO0_15)
PIO0_18_GPIO_ARD: U1.56(PIO0_18)
PIO1_5_GPIO_ARD: U1.31(PIO1_5)
PIO1_8_GPIO_ARD: U1.24(PIO1_8)
PIO1_9_GPIO_ARD: R75.1 R77.2 U1.10(PIO1_9)
PIO1_10_GPIO_ARD: U1.40(PIO1_10)
PIO1_11_GPIO_ARD: U1.93(PIO1_11)
PLU_CLKIN/GPIO/SD1_D0: U1.77(PIO1_25)
PLU_IN0/GPIO: U1.91(PIO1_31)
PLU_IN3/GPIO: U1.73(PIO1_28)
PLU_IN4/GPIO: U1.85(PIO1_27)
PLU_IN5/GPIO/SD1_WP: U1.68(PIO1_26)
PLU_OUT1/GPIO: U1.58(PIO1_19)
PLU_OUT4/GPIO: U1.41(PIO1_22)
PLU_OUT5/GPIO/SD1_D3/FC4_SPI_SSEL2: U1.42(PIO1_23)
PLU_OUT6/GPIO/FC2_USART_RXD_ARD/SD1_D1: U1.3(PIO1_24)
~{SD0_CARD_DET}: U1.8(PIO0_17)
~{SD1_CARD_DET}: U1.43(PIO1_17)
SD0_CLK: U1.6(PIO0_7)
SD0_CMD: U1.26(PIO0_8)
SD0_D0: U1.70(PIO0_24)
SD0_D1: U1.79(PIO0_25)
SD0_D2: U1.23(PIO0_31)
SD0_D3: U1.11(PIO1_0)
SD0_PWR_EN: U1.55(PIO0_9)
SD1_CLK: U1.7(PIO0_1)
SD1_CMD: U1.57(PIO1_14)
SD1_D2: U1.82(PIO1_15)
SD1_PWR_EN: U1.87(PIO1_16)
SWDCLK_TRGT: R112.2 U1.13(PIO0_11)
SWO_TRGT: R113.1 U1.21(PIO0_10)
~{USB0_OVERCURRENT}: U1.66(PIO0_28)
~{USB0_PORTPWR}: U1.67(PIO1_12)
~{USB1_OVERCURRENT}: U1.65(PIO1_30)
~{USB1_PORTPWR}: U1.80(PIO1_29)
USB0_VBUS: U1.78(PIO0_22)
WAKE/GPIO: R74.1 R76.2 U1.64(PIO1_18)
NetD8_1: D8.1 R78.2
NetD8_3: D8.3 R80.2
NetD8_4: D8.4 R79.2
NetP28_1: P28.1 R83.2
NetP28_3: P28.3 R39.2
NetR76_1: R76.1 S2.1
NetR77_1: R77.1 S3.1

Not connected (* = marked no-connect by the designer): F1 1; F2 1; F3 1; F4 1; S1 3 4; S2 3 4; S3 3 4

### Layout directives
net class ADC: ADC0_N, ADC0_P

### Notes on the sheet
- USART external connection
- ADC external connection
- Use J10 to held low ISP pin
- Project:
- Sheet:
- Revision:
- Date:
- Size:
- Sheet number:
- Engineer
- Checked by:
- A3
- of
- www.code-ing.com

### Library data of the parts
D8 = XR3528UEUGUB: LED RGB SMD DIFF 4-PLCC; DigiKey: *; Manufacturer part #: XR3528UEUGUB; Creation date: 04-06-2019; Created by: cmartinez; Modified by: *; Indications: *; Value: *
J10 = 61300211121: as J7 on sheet LPCXpresso55SXX_POWER-USB; Manufacturer part #: 61300211121; Modified by: *; Value: *; Created by: gmoreno; Creation date: 28-Jul-2012
P8 = 61300311121: as J6 on sheet LPCXpresso55SXX_POWER-USB; Manufacturer part #: 61300311121; DigiKey: *; Indications: *; Modified by: *; Value: *; Created by: gmoreno; Creation date: 28-Jul-2012
P28 = 61300311121: as P15 on sheet LPCXpresso55SXX_POWER-USB; Manufacturer part #: 61300311121; DigiKey: *; Modified by: *; Value: *; Created by: gmoreno; Creation date: 28-Jul-2012
R39 R83 = CMP-1011-00001-1: as R85 on sheet LPCXpresso55SXX_POWER-USB; Power: None; Technology: SMT
R71 R72 R117-R121 R124 = CMP-1011-00546-1: 2K2 0.063W 1% 0402 (1005 Metric)  SMD; Case-Metric: 1005; Case-EIA: 0402; Power: 0.063 W; Tolerance: 1 %; Technology: SMT
R74 = CMP-1011-00793-1: 330K 0.063W 1% 0402 (1005 Metric)  SMD; Case-Metric: 1005; Case-EIA: 0402; Technology: SMT; Power: 0.063 W; Tolerance: 1 %
R75 R112 R113 R115 R116 R123 = CMP-2002-00608-3: as R88 on sheet LPCXpresso55SXX_POWER-USB; Case Code (Imperial): 0402; RoHSCompliant: true; Min Operating Temperature: -55 degC; Mount: Surface Mount; Packaging: Tape and Reel; PackageDescription: 2-Pin Surface Mount Device, Body 1 x 0.5 mm; Tolerance: 1%; REACH SVHC: Yes; ComponentLink1URL: http://www.panasonic.com/; ComponentLink1Description: Manufacturer URL; Package Quantity: 10000; Mounting Technology: Surface Mount; DatasheetVersion: 04/2015; PartNumber: ERJ-2RKF1003X; Height: 0.35 mm; Pins: 2; Length: 1 mm; Max Operating Temperature: 155 degC; ComponentLink2Description: Datasheet; ComponentLink2URL: http://industrial.panasonic.com/cdbs/www-data/pdf/RDA0000/AOA0000C86.pdf; PackageReference: 0402; Radiation Hardening: No; Width: 0.5 mm; Case Code (Metric): 1005
R76 R77 = CMP-1011-00050-1: as R94 on sheet LPCXpresso55SXX_POWER-USB; Power: 0.063 W; Technology: SMT; Tolerance: 5 %
R78 R79 = CMP-1011-00444-1: 270R 0.063W 1% 0402 (1005 Metric)  SMD; Case-EIA: 0402; Case-Metric: 1005; Technology: SMT; Tolerance: 1 %; Power: 0.063 W
R80 = CMP-1011-00476-1: 499R 0.063W 1% 0402 (1005 Metric)  SMD; Case-EIA: 0402; Case-Metric: 1005; Technology: SMT; Tolerance: 1 %; Power: 0.063 W
R114 = CMP-2002-00608-3: as R73 on sheet LPCXpresso55SXX_POWER-USB; Case Code (Imperial): 0402; RoHSCompliant: true; Min Operating Temperature: -55 degC; Mount: Surface Mount; Packaging: Tape and Reel; PackageDescription: 2-Pin Surface Mount Device, Body 1 x 0.5 mm; Tolerance: 1%; REACH SVHC: Yes; ComponentLink1URL: http://www.panasonic.com/; ComponentLink1Description: Manufacturer URL; Package Quantity: 10000; Mounting Technology: Surface Mount; DatasheetVersion: 04/2015; PartNumber: ERJ-2RKF1003X; Height: 0.35 mm; Pins: 2; Length: 1 mm; Max Operating Temperature: 155 degC; ComponentLink2Description: Datasheet; ComponentLink2URL: http://industrial.panasonic.com/cdbs/www-data/pdf/RDA0000/AOA0000C86.pdf; PackageReference: 0402; Radiation Hardening: No; Width: 0.5 mm; Case Code (Metric): 1005
S1-S3 = KMR221GLFS: as S4 on sheet LPCXpresso55SXX_POWER-USB; Created by: eteofilo; Creation Date: 06-Jul-2017; Indications: *; Manufacturer part #: KMR221GLFS; Modified by: *; Value: *
U1 = LPC5500: as U1 on sheet LPCXpresso55SXX_POWER-USB; Manufacturer Part #: LPC5500; Created by: eteofilo; Creation Date: 05-Apr-2018; Modified by: *; Indications: *; Value: *
F1-F4 = Fiducial 1.5mm: Manufacturer: *; Manufacturer Part #: *; Created by: lsanchez; Creation Date: 05-Sep-2017; Value: *; Indications: *; Modified by: *

## Sheet SHIELD-uSD-MIKROE-PMOD.SchDoc
size A3; CheckedBy: José Ogando; Engineer: Eduardo Teofilo; Revision: A2; SheetNumber: 5; SheetTotal: 8
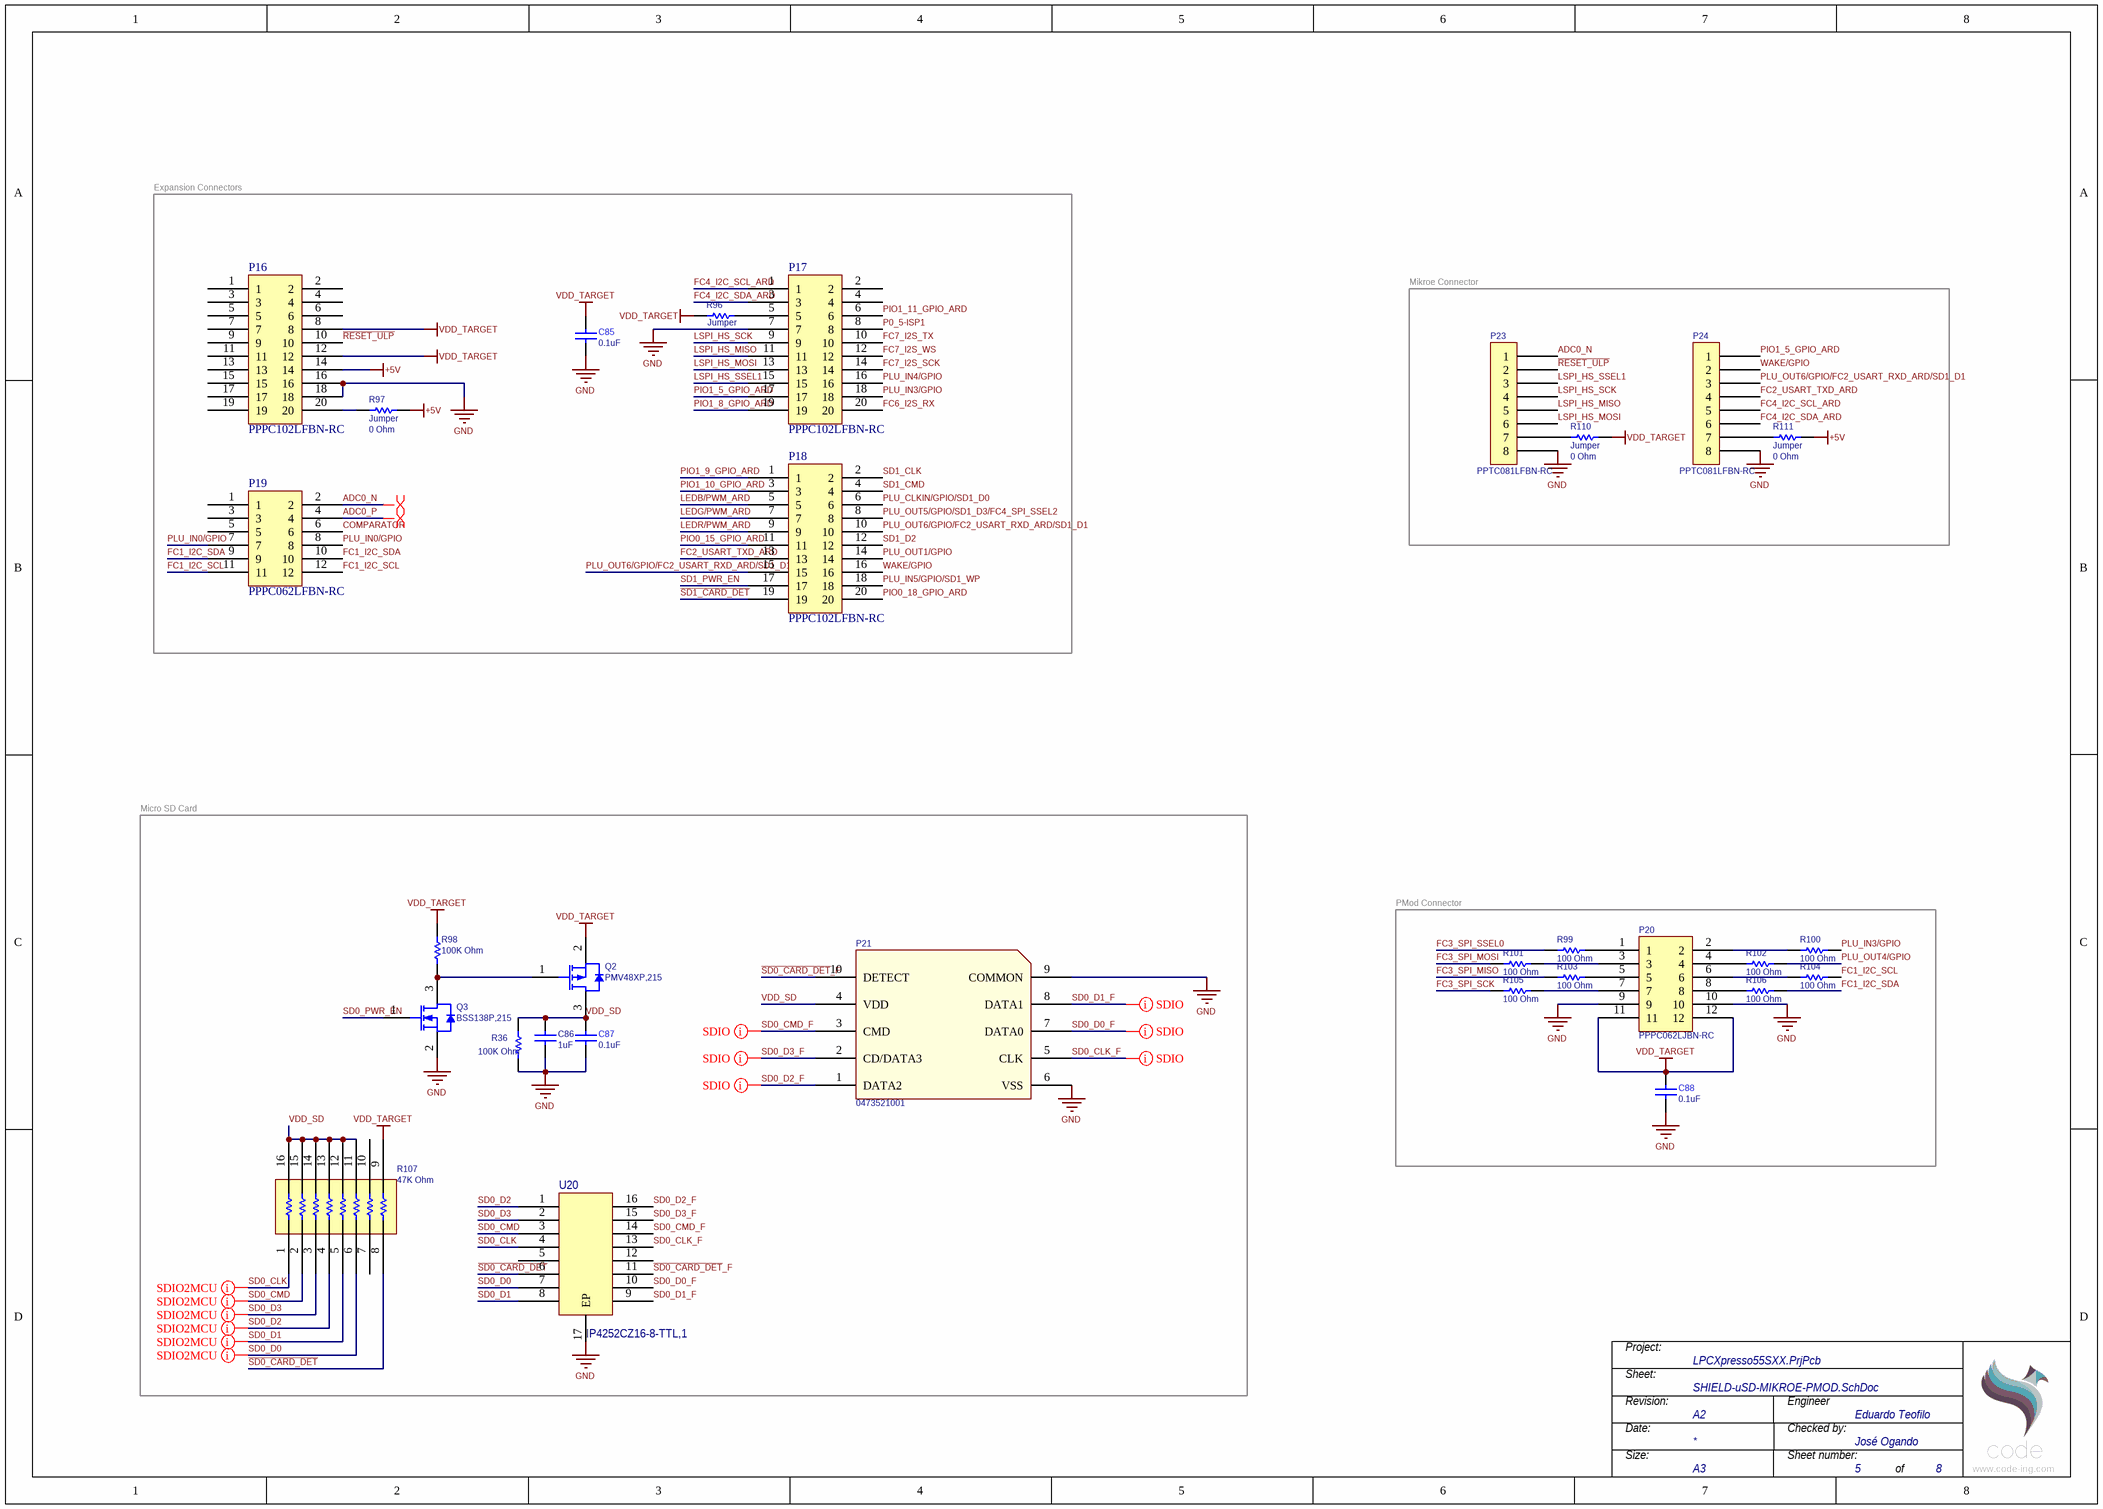
[diagram p3: SHIELD-uSD-MIKROE-PMOD.SchDoc]

### Parts
C85  value 0.1uF  [CAPC1005]  (hidden comment: CC0402KRX7R7BB104)
C86  value 1uF  [CAPC0402(1005)60_L]  (hidden comment: CAP 1uF 10V 0402(1005))
C87  value 0.1uF  [CAPC1005]  (hidden comment: CC0402KRX7R7BB104)
C88  value 0.1uF  [CAPC1005]  (hidden comment: CC0402KRX7R7BB104)
P16  PPPC102LFBN-RC  [PPPC102LFBN-RC]
P17  PPPC102LFBN-RC  [PPPC102LFBN-RC]
P18  PPPC102LFBN-RC  [PPPC102LFBN-RC]
P19  PPPC062LFBN-RC  [PPPC062LFBN-RC]
P20  PPPC062LJBN-RC  [PPPC062LJBN-RC]
P21  0473521001  [0473521001]
P23  PPTC081LFBN-RC  [Header 8x1]
P24  PPTC081LFBN-RC  [Header 8x1]
Q2  PMV48XP,215  [NXP-SOT23_M]
Q3  BSS138P,215  [NXP-SOT23_N]
R36  value 100K Ohm  [RESC1005X40X25LL05T05]  (hidden comment: ERJ-2RKF1003X)
R96  Jumper  [RESC0402(1005)_L]
R97  Jumper  value 0 Ohm  [RESC0402(1005)_L]
R98  value 100K Ohm  [RESC1005X40X25LL05T05]  (hidden comment: ERJ-2RKF1003X)
R99  value 100 Ohm  [RESC0402(1005)_L]  (hidden comment: 100R 5% 0402(1005))
R100  value 100 Ohm  [RESC0402(1005)_L]  (hidden comment: 100R 5% 0402(1005))
R101  value 100 Ohm  [RESC0402(1005)_L]  (hidden comment: 100R 5% 0402(1005))
R102  value 100 Ohm  [RESC0402(1005)_L]  (hidden comment: 100R 5% 0402(1005))
R103  value 100 Ohm  [RESC0402(1005)_L]  (hidden comment: 100R 5% 0402(1005))
R104  value 100 Ohm  [RESC0402(1005)_L]  (hidden comment: 100R 5% 0402(1005))
R105  value 100 Ohm  [RESC0402(1005)_L]  (hidden comment: 100R 5% 0402(1005))
R106  value 100 Ohm  [RESC0402(1005)_L]  (hidden comment: 100R 5% 0402(1005))
R107  value 47K Ohm  [EXB-2HV473JV]  (hidden comment: EXB-2HV473JV)
R110  Jumper  value 0 Ohm  [RESC0402(1005)_L]
R111  Jumper  value 0 Ohm  [RESC0402(1005)_L]
U20  IP4252CZ16-8-TTL,1  [HUSON16]

### Blocks framed on the sheet
Expansion Connectors: C85 P16-P19 R96 R97
Mikroe Connector: P23 P24 R110 R111
Micro SD Card: C86 C87 P21 Q2 Q3 R36 R98 R107 U20
PMod Connector: C88 P20 R99-R106

### Nets
+5V: P16.14 R97.1 R111.1
GND: C85.2 C86.1 C87.2 C88.2 P16.16 P16.18 P17.7 P20.9 P20.10 P21.6(VSS) P21.9(COMMON) P23.8 P24.8 Q3.2(S) R36.1 U20.17(EP)
VDD_TARGET: C85.1 C88.1 P16.8 P16.12 P20.11 P20.12 Q2.2(S) R96.2 R98.2 R107.9 R110.1
ADC0_N: P19.2 P23.1
ADC0_P: P19.4
COMPARATOR: P19.6
FC1_I2C_SCL: P19.11 P19.12 R104.2
FC1_I2C_SDA: P19.9 P19.10 R106.2
FC2_USART_TXD_ARD: P18.13 P24.4
FC3_SPI_MISO: R103.1
FC3_SPI_MOSI: R101.1
FC3_SPI_SCK: R105.1
FC3_SPI_SSEL0: R99.1
FC4_I2C_SCL_ARD: P17.1 P24.5
FC4_I2C_SDA_ARD: P17.3 P24.6
FC6_I2S_RX: P17.20
FC7_I2S_SCK: P17.14
FC7_I2S_TX: P17.10
FC7_I2S_WS: P17.12
LEDB/PWM_ARD: P18.5
LEDG/PWM_ARD: P18.7
LEDR/PWM_ARD: P18.9
LSPI_HS_MISO: P17.11 P23.5
LSPI_HS_MOSI: P17.13 P23.6
LSPI_HS_SCK: P17.9 P23.4
LSPI_HS_SSEL1: P17.15 P23.3
P0_5-ISP1: P17.8
PIO0_15_GPIO_ARD: P18.11
PIO0_18_GPIO_ARD: P18.20
PIO1_5_GPIO_ARD: P17.17 P24.1
PIO1_8_GPIO_ARD: P17.19
PIO1_9_GPIO_ARD: P18.1
PIO1_10_GPIO_ARD: P18.3
PIO1_11_GPIO_ARD: P17.6
PLU_CLKIN/GPIO/SD1_D0: P18.6
PLU_IN0/GPIO: P19.7 P19.8
PLU_IN3/GPIO: P17.18 R100.2
PLU_IN4/GPIO: P17.16
PLU_IN5/GPIO/SD1_WP: P18.18
PLU_OUT1/GPIO: P18.14
PLU_OUT4/GPIO: R102.2
PLU_OUT5/GPIO/SD1_D3/FC4_SPI_SSEL2: P18.8
PLU_OUT6/GPIO/FC2_USART_RXD_ARD/SD1_D1: P18.10 P18.15 P24.3
~{RESET_ULP}: P16.10 P23.2
~{SD0_CARD_DET}: R107.8 U20.6
~{SD0_CARD_DET}_F: P21.10(DETECT) U20.11
~{SD1_CARD_DET}: P18.19
SD0_CLK: R107.1 U20.4
SD0_CLK_F: P21.5(CLK) U20.13
SD0_CMD: R107.2 U20.3
SD0_CMD_F: P21.3(CMD) U20.14
SD0_D0: R107.6 U20.7
SD0_D0_F: P21.7(DATA0) U20.10
SD0_D1: R107.5 U20.8
SD0_D1_F: P21.8(DATA1) U20.9
SD0_D2: R107.4 U20.1
SD0_D2_F: P21.1(DATA2) U20.16
SD0_D3: R107.3 U20.2
SD0_D3_F: P21.2(CD/DATA3) U20.15
SD0_PWR_EN: Q3.1(G)
SD1_CLK: P18.2
SD1_CMD: P18.4
SD1_D2: P18.12
SD1_PWR_EN: P18.17
VDD_SD: C86.2 C87.1 P21.4(VDD) Q2.3(D) R36.2 R107.11 R107.12 R107.13 R107.14 R107.15 R107.16
WAKE/GPIO: P18.16 P24.2
NetP16_20: P16.20 R97.2
NetP17_5: P17.5 R96.1
NetP20_1: P20.1 R99.2
NetP20_2: P20.2 R100.1
NetP20_3: P20.3 R101.2
NetP20_4: P20.4 R102.1
NetP20_5: P20.5 R103.2
NetP20_6: P20.6 R104.1
NetP20_7: P20.7 R105.2
NetP20_8: P20.8 R106.1
NetP23_7: P23.7 R110.2
NetP24_7: P24.7 R111.2
NetQ2_1: Q2.1(G) Q3.3(D) R98.1

Not connected (* = marked no-connect by the designer): P16 1 2 3 4 5 6 7 9 11 13 15 17 19; P17 2 4; P19 1 3 5; R107 7 10; U20 5 12

### Layout directives
net class SDIO: SD0_CLK_F, SD0_CMD_F, SD0_D0_F, SD0_D1_F, SD0_D2_F, SD0_D3_F
net class SDIO2MCU: SD0_CLK, SD0_CMD, SD0_D0, SD0_D1, SD0_D2, SD0_D3
differential pair: ADC0_N, ADC0_P

### Notes on the sheet
- Project:
- Sheet:
- Revision:
- Date:
- Size:
- Sheet number:
- Engineer
- Checked by:
- A3
- of
- www.code-ing.com

### Library data of the parts
C85 C87 C88 = CMP-0001-00074-1: as C71 on sheet LPCXpresso55SXX_POWER-USB; ClassName: Board Template Device; Rated Voltage: 16 V; Status: Production; Tolerance: 10 %; Mounting Technology: Surface Mount; Technology: Ceramic; Category: Capacitor; Dielectric: X7R; Publisher: Altium
C86 = CMP-1034-02118-1: CAP 1uF 10V -20% to +80% 0402 (1005 Metric) Thickness 0.6mm SMD; Case-EIA: 0402; Case-Metric: 1005; Tolerance: -20% to +80%; Max Thickness: 0.6 mm; Rated Voltage: 10 V; Technology: SMT
P16-P18 = PPPC102LFBN-RC: CONN HEADER FMAL 20PS.1" DL GOLD; Manufacturer: Sullins Connector Solutions; Manufacturer Part #: PPPC102LFBN-RC; Created by: jvelasquez; Creation date: 05-Apr-2018; Modified by: *; Indications: *; Value: *
P19 = PPPC062LFBN-RC: CONN HEADER FMAL 12PS.1" DL GOLD; Manufacturer: Sullins Connector Solutions; Manufacturer Part #: PPPC062LFBN-RC; Created by: jvelasquez; Creation date: 05-Apr-2018; Modified by: *; Indications: *; Value: *
P20 = PPPC062LJBN-RC: CONN FEMALE 12POSDL .1" R/A GOLD; Manufacturer: Sullins Connector Solutions; Manufacturer Part #: PPPC062LJBN-RC; Created by: eteofilo; Creation date: 17-Apr-2018; Modified by: *; Value: *
P21 = 0473521001: CONN MICRO SD CARD PUSH-PUSH R/A; Manufacturer: Molex Inc; Manufacturer part #: 0473521001; Indications: *; Created by: eteofilo; Creation date: 17-Apr-2018; Value: *; Modified by: *
P23 P24 = PPTC081LFBN-RC: CONN HEADER FEMALE 8POS .1" TIN; Manufacturer: Sullins Connector Solutions; Manufacturer Part #: PPTC081LFBN-RC; Created by: eteofilo; Creation Date: 10-May-2018; Modified by: *; Value: *; Indicattions: *
Q2 = CMP-1258-00160-1: P-Channel Trench MOSFET, -20 V, -3.5 A, -55 to 150 degC, 3-Pin SOT23, Tape and Reel; Manufacturer: NXP Semiconductors; VGSth [typ] (V): -1; Ciss [typ] (pF): 1000; Coss [typ] (pF): 130; Channel Type: P; Packing: Tape & Reel; PackageVersion: 06-03-16, 03/2006; ComponentLink3Description: Package Specification; Mounting Technology: Surface Mount; DatasheetVersion: Rev. 1; ComponentLink2Description: Datasheet; VDS [max] (V): -20; ComponentLink1URL: http://www.nxp.com/; ComponentLink3URL: http://www.nxp.com/documents/outline_drawing/sot023_po.pdf; ID [max] (A): -3.5; ComponentLink2URL: http://www.nxp.com/documents/data_sheet/PMV48XP.pdf; PackageDescription: 3-Pin Small Outline Transistor Package, Body 2.9 x 1.3 mm, Pitch 0.95 mm; ComponentLink1Description: Manufacturer URL; PackageReference: SOT23; PartNumber: PMV48XP,215; Code_JEDEC: TO-236AB
Q3 = CMP-1259-00085-1: as Q1 on sheet LPCXpresso55SXX_POWER-USB; ComponentLink1URL: http://www.nxp.com/; ComponentLink1Description: Manufacturer URL; Code_JEDEC: TO-236AB; PackageReference: SOT23; PartNumber: BSS138P,215; ComponentLink2URL: http://www.nxp.com/documents/data_sheet/BSS138P.pdf; PackageDescription: 3-Pin Small Outline Transistor Package, Body 2.9 x 1.3 mm, Pitch 0.95 mm; VGSth [typ] (V): 1.2; DatasheetVersion: Rev. 1; Mounting Technology: Surface Mount; ComponentLink3URL: http://www.nxp.com/documents/outline_drawing/sot023_po.pdf; ComponentLink3Description: Package Specification; ComponentLink2Description: Datasheet; PackageVersion: 06-03-16, 03/2006
R36 = CMP-2002-00608-3: as R73 on sheet LPCXpresso55SXX_POWER-USB; Case Code (Imperial): 0402; RoHSCompliant: true; Min Operating Temperature: -55 degC; Mount: Surface Mount; Packaging: Tape and Reel; PackageDescription: 2-Pin Surface Mount Device, Body 1 x 0.5 mm; Tolerance: 1%; REACH SVHC: Yes; ComponentLink1URL: http://www.panasonic.com/; ComponentLink1Description: Manufacturer URL; Package Quantity: 10000; Mounting Technology: Surface Mount; DatasheetVersion: 04/2015; PartNumber: ERJ-2RKF1003X; Height: 0.35 mm; Pins: 2; Length: 1 mm; Max Operating Temperature: 155 degC; ComponentLink2Description: Datasheet; ComponentLink2URL: http://industrial.panasonic.com/cdbs/www-data/pdf/RDA0000/AOA0000C86.pdf; PackageReference: 0402; Radiation Hardening: No; Width: 0.5 mm; Case Code (Metric): 1005
R96 = CMP-1011-00001-1: as R85 on sheet LPCXpresso55SXX_POWER-USB; Power: None; Technology: SMT
R97 R110 R111 = CMP-1011-00001-1: Jumper 0402 (1005 Metric); Tolerance: None; Case-Metric: 1005; Case-EIA: 0402; Power: None; Technology: SMT
R98 = CMP-2002-00608-3: as R88 on sheet LPCXpresso55SXX_POWER-USB; Case Code (Imperial): 0402; RoHSCompliant: true; Min Operating Temperature: -55 degC; Mount: Surface Mount; Packaging: Tape and Reel; PackageDescription: 2-Pin Surface Mount Device, Body 1 x 0.5 mm; Tolerance: 1%; REACH SVHC: Yes; ComponentLink1URL: http://www.panasonic.com/; ComponentLink1Description: Manufacturer URL; Package Quantity: 10000; Mounting Technology: Surface Mount; DatasheetVersion: 04/2015; PartNumber: ERJ-2RKF1003X; Height: 0.35 mm; Pins: 2; Length: 1 mm; Max Operating Temperature: 155 degC; ComponentLink2Description: Datasheet; ComponentLink2URL: http://industrial.panasonic.com/cdbs/www-data/pdf/RDA0000/AOA0000C86.pdf; PackageReference: 0402; Radiation Hardening: No; Width: 0.5 mm; Case Code (Metric): 1005
R99-R106 = CMP-1011-00050-1: as R94 on sheet LPCXpresso55SXX_POWER-USB; Power: 0.063 W; Technology: SMT; Tolerance: 5 %
R107 = EXB-2HV473JV: RES ARRAY 8 RES 47K OHM 1506; Manufacturer: Panasonic Electronic Components; Indications: *; Created by: eteofilo; Creation date: 17-Apr-2018; Manufacturer part #: EXB-2HV473JV; Modified by: *
U20 = IP4252CZ16-8-TTL,1: Manufacturer: Nexperia USA Inc.; Manufacturer Part #: IP4252CZ16-8-TTL,1; Created by: eteofilo; Creation Date: 17-Apr-2018; Modified by: *; Indications: *; Value: *

## Sheet BRIDGE-ACCELEROMETER.SchDoc
size A3; CheckedBy: José Ogando; Engineer: Eduardo Teofilo; Revision: A2; SheetNumber: 4; SheetTotal: 8
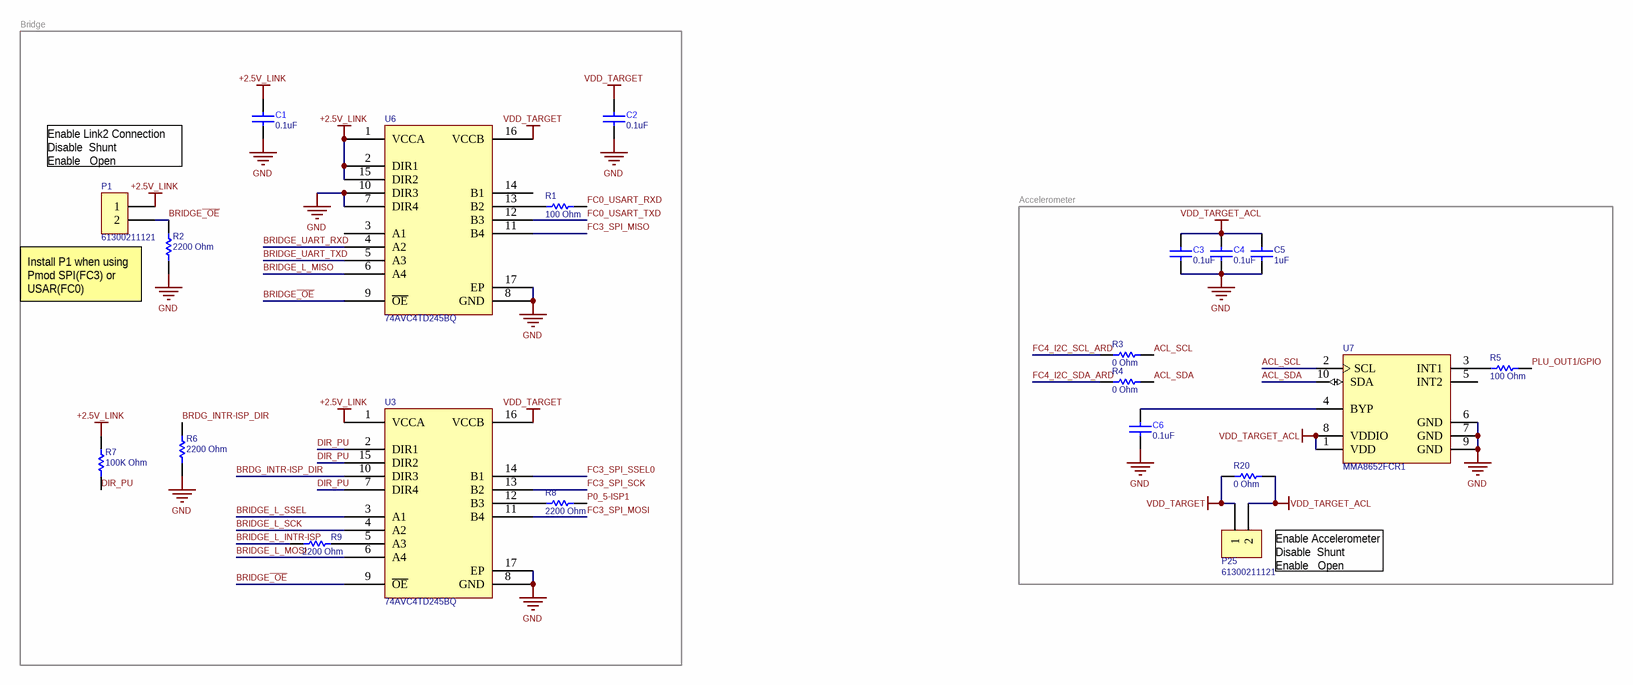
[diagram p4: BRIDGE-ACCELEROMETER.SchDoc]

### Parts
C1  value 0.1uF  [CAPC1005]  (hidden comment: CC0402KRX7R7BB104)
C2  value 0.1uF  [CAPC1005]  (hidden comment: CC0402KRX7R7BB104)
C3  value 0.1uF  [CAPC1005]  (hidden comment: CC0402KRX7R7BB104)
C4  value 0.1uF  [CAPC1005]  (hidden comment: CC0402KRX7R7BB104)
C5  value 1uF  [CAPC0402(1005)60_L]  (hidden comment: CAP 1uF 10V 0402(1005))
C6  value 0.1uF  [CAPC1005]  (hidden comment: CC0402KRX7R7BB104)
P1  61300211121  [61300211121]
P25  61300211121  [61300211121]
R1  value 100 Ohm  [RESC0402(1005)_L]  (hidden comment: 100R 5% 0402(1005))
R2  value 2200 Ohm  [RESC0402(1005)_L]  (hidden comment: 2K2 1% 0402(1005))
R3  value 0 Ohm  [RESC0402(1005)_L]  (hidden comment: Jumper 0402(1005))
R4  value 0 Ohm  [RESC0402(1005)_L]  (hidden comment: Jumper 0402(1005))
R5  value 100 Ohm  [RESC0402(1005)_L]  (hidden comment: 100R 5% 0402(1005))
R6  value 2200 Ohm  [RESC0402(1005)_L]  (hidden comment: 2K2 1% 0402(1005))
R7  value 100K Ohm  [RESC1005X40X25LL05T05]  (hidden comment: ERJ-2RKF1003X)
R8  value 2200 Ohm  [RESC0402(1005)_L]  (hidden comment: 2K2 1% 0402(1005))
R9  value 2200 Ohm  [RESC0402(1005)_L]  (hidden comment: 2K2 1% 0402(1005))
R20  value 0 Ohm  [RESC0402(1005)_L]  (hidden comment: Jumper 0402(1005))
U3  74AVC4TD245BQ  [DHVQFN16 (NXP)]
U6  74AVC4TD245BQ  [DHVQFN16 (NXP)]
U7  MMA8652FCR1  [FRES-2162-02_V]

### Nets
+2.5V_LINK: C1.1 P1.1 R7.2 U3.1(VCCA) U6.1(VCCA) U6.2(DIR1) U6.15(DIR2)
GND: C1.2 C2.2 C3.2 C4.2 C5.1 C6.2 R2.2 R6.1 U3.8(GND) U3.17(EP) U6.7(DIR4) U6.8(GND) U6.10(DIR3) U6.17(EP) U7.6(GND) U7.7(GND) U7.9(GND)
VDD_TARGET: C2.1 P25.1 R20.2 U3.16(VCCB) U6.16(VCCB)
VDD_TARGET_ACL: C3.1 C4.1 C5.2 P25.2 R20.1 U7.1(VDD) U7.8(VDDIO)
ACL_SCL: R3.1 U7.2(SCL)
ACL_SDA: R4.1 U7.10(SDA)
BRDG_INTR-ISP_DIR: R6.2 U3.10(DIR3)
BRIDGE~{_OE}: P1.2 R2.1 U3.9(~{OE}) U6.9(~{OE})
BRIDGE_L_INTR-ISP: R9.2
BRIDGE_L_MISO: U6.6(A4)
BRIDGE_L_MOSI: U3.6(A4)
BRIDGE_L_SCK: U3.4(A2)
BRIDGE_L_SSEL: U3.3(A1)
BRIDGE_UART_RXD: U6.4(A2)
BRIDGE_UART_TXD: U6.5(A3)
DIR_PU: R7.1 U3.2(DIR1) U3.7(DIR4) U3.15(DIR2)
FC0_USART_RXD: R1.2
FC0_USART_TXD: U6.12(B3)
FC3_SPI_MISO: U6.11(B4)
FC3_SPI_MOSI: U3.11(B4)
FC3_SPI_SCK: U3.13(B2)
FC3_SPI_SSEL0: U3.14(B1)
FC4_I2C_SCL_ARD: R3.2
FC4_I2C_SDA_ARD: R4.2
P0_5-ISP1: R8.1
PLU_OUT1/GPIO: R5.2
NetC6_1: C6.1 U7.4(BYP)
NetR1_1: R1.1 U6.13(B2)
NetR5_1: R5.1 U7.3(INT1)
NetR8_2: R8.2 U3.12(B3)
NetR9_1: R9.1 U3.5(A3)

Not connected (* = marked no-connect by the designer): U6 3(A1) 14(B1); U7 5(INT2)

### Notes on the sheet
- Bridge
- (near P1) Enable Link2 Connection
  Disable  Shunt
  Enable   Open
- Accelerometer
- Install P1 when using Pmod SPI(FC3) or USAR(FC0)
- (near P25) Enable Accelerometer
  Disable  Shunt
  Enable   Open
- Project:
- Sheet:
- Revision:
- Date:
- Size:
- Sheet number:
- Engineer
- Checked by:
- A3
- of
- www.code-ing.com

### Library data of the parts
C1-C4 C6 = CMP-0001-00074-1: as C71 on sheet LPCXpresso55SXX_POWER-USB; ClassName: Board Template Device; Rated Voltage: 16 V; Status: Production; Tolerance: 10 %; Mounting Technology: Surface Mount; Technology: Ceramic; Category: Capacitor; Dielectric: X7R; Publisher: Altium
C5 = CMP-1034-02118-1: as C86 on sheet SHIELD-uSD-MIKROE-PMOD; Tolerance: -20% to +80%; Max Thickness: 0.6 mm; Rated Voltage: 10 V; Technology: SMT
P1 = 61300211121: as J7 on sheet LPCXpresso55SXX_POWER-USB; Manufacturer part #: 61300211121; Indications: *; Modified by: *; Value: *; Created by: gmoreno; Creation date: 28-Jul-2012
P25 = 61300211121: as J11 on sheet LPCXpresso55SXX_POWER-USB; Manufacturer part #: 61300211121; Modified by: *; Value: *; Created by: gmoreno; Creation date: 28-Jul-2012
R1 R5 = CMP-1011-00050-1: as R94 on sheet LPCXpresso55SXX_POWER-USB; Power: 0.063 W; Technology: SMT; Tolerance: 5 %
R2 R6 R8 R9 = CMP-1011-00546-1: as R71 on sheet LPCXpresso55SXX_MCU; Power: 0.063 W; Tolerance: 1 %; Technology: SMT
R3 R4 R20 = CMP-1011-00001-1: as R97 on sheet SHIELD-uSD-MIKROE-PMOD; Power: None; Technology: SMT
R7 = CMP-2002-00608-3: as R88 on sheet LPCXpresso55SXX_POWER-USB; Case Code (Imperial): 0402; RoHSCompliant: true; Min Operating Temperature: -55 degC; Mount: Surface Mount; Packaging: Tape and Reel; PackageDescription: 2-Pin Surface Mount Device, Body 1 x 0.5 mm; Tolerance: 1%; REACH SVHC: Yes; ComponentLink1URL: http://www.panasonic.com/; ComponentLink1Description: Manufacturer URL; Package Quantity: 10000; Mounting Technology: Surface Mount; DatasheetVersion: 04/2015; PartNumber: ERJ-2RKF1003X; Height: 0.35 mm; Pins: 2; Length: 1 mm; Max Operating Temperature: 155 degC; ComponentLink2Description: Datasheet; ComponentLink2URL: http://industrial.panasonic.com/cdbs/www-data/pdf/RDA0000/AOA0000C86.pdf; PackageReference: 0402; Radiation Hardening: No; Width: 0.5 mm; Case Code (Metric): 1005
U3 U6 = 74AVC4TD245BQ: TXRX 4BIT DUAL 3STATE 16-DHVQFN; Manufacturer: NXP Semiconductors; Created By: Jose; Creation Date: 25-Apr-2016; Modified by: *; Indications: *; Value: *; Manufacturer Part #: 74AVC4TD245BQ
U7 = CMP-1356-00001-1: MMA8652FC 3-Axis, 12-bit Digital Accelerometer, 1.95 to 3.6 V, -40 to 85 degC, 10-Pin DFN (2162-02), RoHS, Tape and Reel; Manufacturer: Freescale Semiconductor; Digital Output: 12 Bits; fSCL: 0 to 400 kHz; Cap: 75 to 470 nF; ComponentLink3URL: http://cache.freescale.com/files/shared/doc/package_info/98ASA00301D.pdf; PartNumber: MMA8652FCR1; VDD: 1.95 to 3.6 V; PackageDescription: 10-Pin Plastic Dual Flat Package, Body 2 x 2 mm, Pitch 0.4 mm; ComponentLink3Description: Package Specification; ComponentLink1Description: Manufacturer URL; RoHS: TRUE; ComponentLink2URL: http://cache.freescale.com/files/sensors/doc/data_sheet/MMA8652FC.pdf?pspll=1; PackageVersion: Rev. A; DatasheetVersion: Rev. 3.2; Mounting Technology: Surface Mount; Packing: Tape and Reel; ComponentLink2Description: Datasheet; Temperature Range: -40 to 85 degC; ComponentLink1URL: http://www.freescale.com/